# Altium project ROV_Voltage_Switch_1.1.PrjPcb (part 1 of 2)
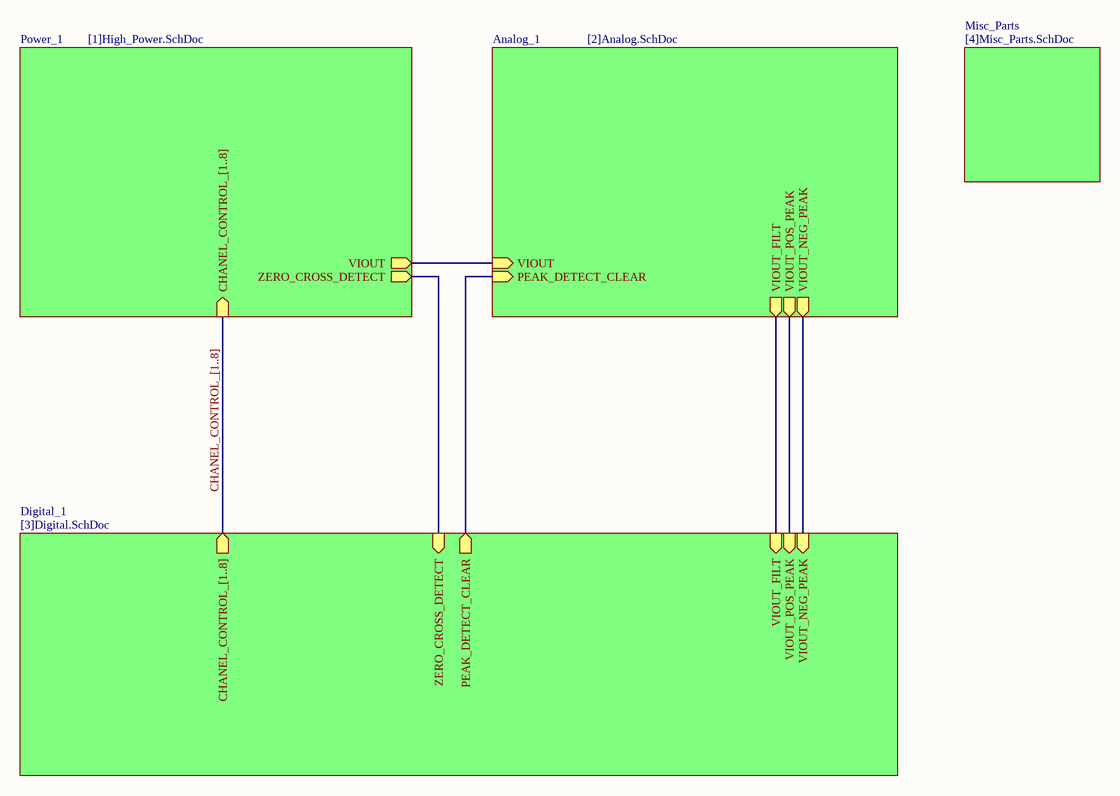
[diagram p0: [0]Top.SchDoc]
6 sheets, 303 parts. Net scope: hierarchical (ports join the sheet entries above them; power ports are global).
Board file: ROV_Voltage_Switch_1.1.PcbDoc
Sheets:
  [0]Top.SchDoc
    Power_1 = [1]High_Power.SchDoc
      MOC_CH_1 = [1.1]MOC_Channel.SchDoc
      MOC_CH_2 = [1.1]MOC_Channel.SchDoc
      MOC_CH_3 = [1.1]MOC_Channel.SchDoc
      MOC_CH_4 = [1.1]MOC_Channel.SchDoc
      MOC_CH_5 = [1.1]MOC_Channel.SchDoc
      MOC_CH_6 = [1.1]MOC_Channel.SchDoc
      MOC_CH_7 = [1.1]MOC_Channel.SchDoc
      MOC_CH_8 = [1.1]MOC_Channel.SchDoc
    Analog_1 = [2]Analog.SchDoc
    Digital_1 = [3]Digital.SchDoc
    Misc_Parts = [4]Misc_Parts.SchDoc

## Sheet [0]Top.SchDoc
size A4

### Sub-sheets
Analog_1 = [2]Analog.SchDoc: VIOUT (in), VIOUT_FILT (out), VIOUT_NEG_PEAK (out), PEAK_DETECT_CLEAR (in), VIOUT_POS_PEAK (out)
Digital_1 = [3]Digital.SchDoc: ZERO_CROSS_DETECT (in), VIOUT_FILT (in), VIOUT_NEG_PEAK (in), VIOUT_POS_PEAK (in), PEAK_DETECT_CLEAR (out), CHANEL_CONTROL_[1..8] (out)
Misc_Parts = [4]Misc_Parts.SchDoc: no entries
Power_1 = [1]High_Power.SchDoc: VIOUT (out), ZERO_CROSS_DETECT (out), CHANEL_CONTROL_[1..8] (in)

### Nets
VIOUT: sheet Power_1/VIOUT, sheet Analog_1/VIOUT
VIOUT_NEG_PEAK: sheet Analog_1/VIOUT_NEG_PEAK, sheet Digital_1/VIOUT_NEG_PEAK
VIOUT_POS_PEAK: sheet Analog_1/VIOUT_POS_PEAK, sheet Digital_1/VIOUT_POS_PEAK
NetOPT1_5: sheet Power_1/ZERO_CROSS_DETECT, sheet Digital_1/ZERO_CROSS_DETECT
NetP9_1: sheet Analog_1/VIOUT_FILT, sheet Digital_1/VIOUT_FILT
NetP17_1: sheet Analog_1/PEAK_DETECT_CLEAR, sheet Digital_1/PEAK_DETECT_CLEAR

### Buses and harness runs
bus CHANEL_CONTROL_[1..8] = sheet Digital_1/CHANEL_CONTROL_[1..8] = sheet Power_1/CHANEL_CONTROL_[1..8]

## Sheet [1]High_Power.SchDoc
size A1
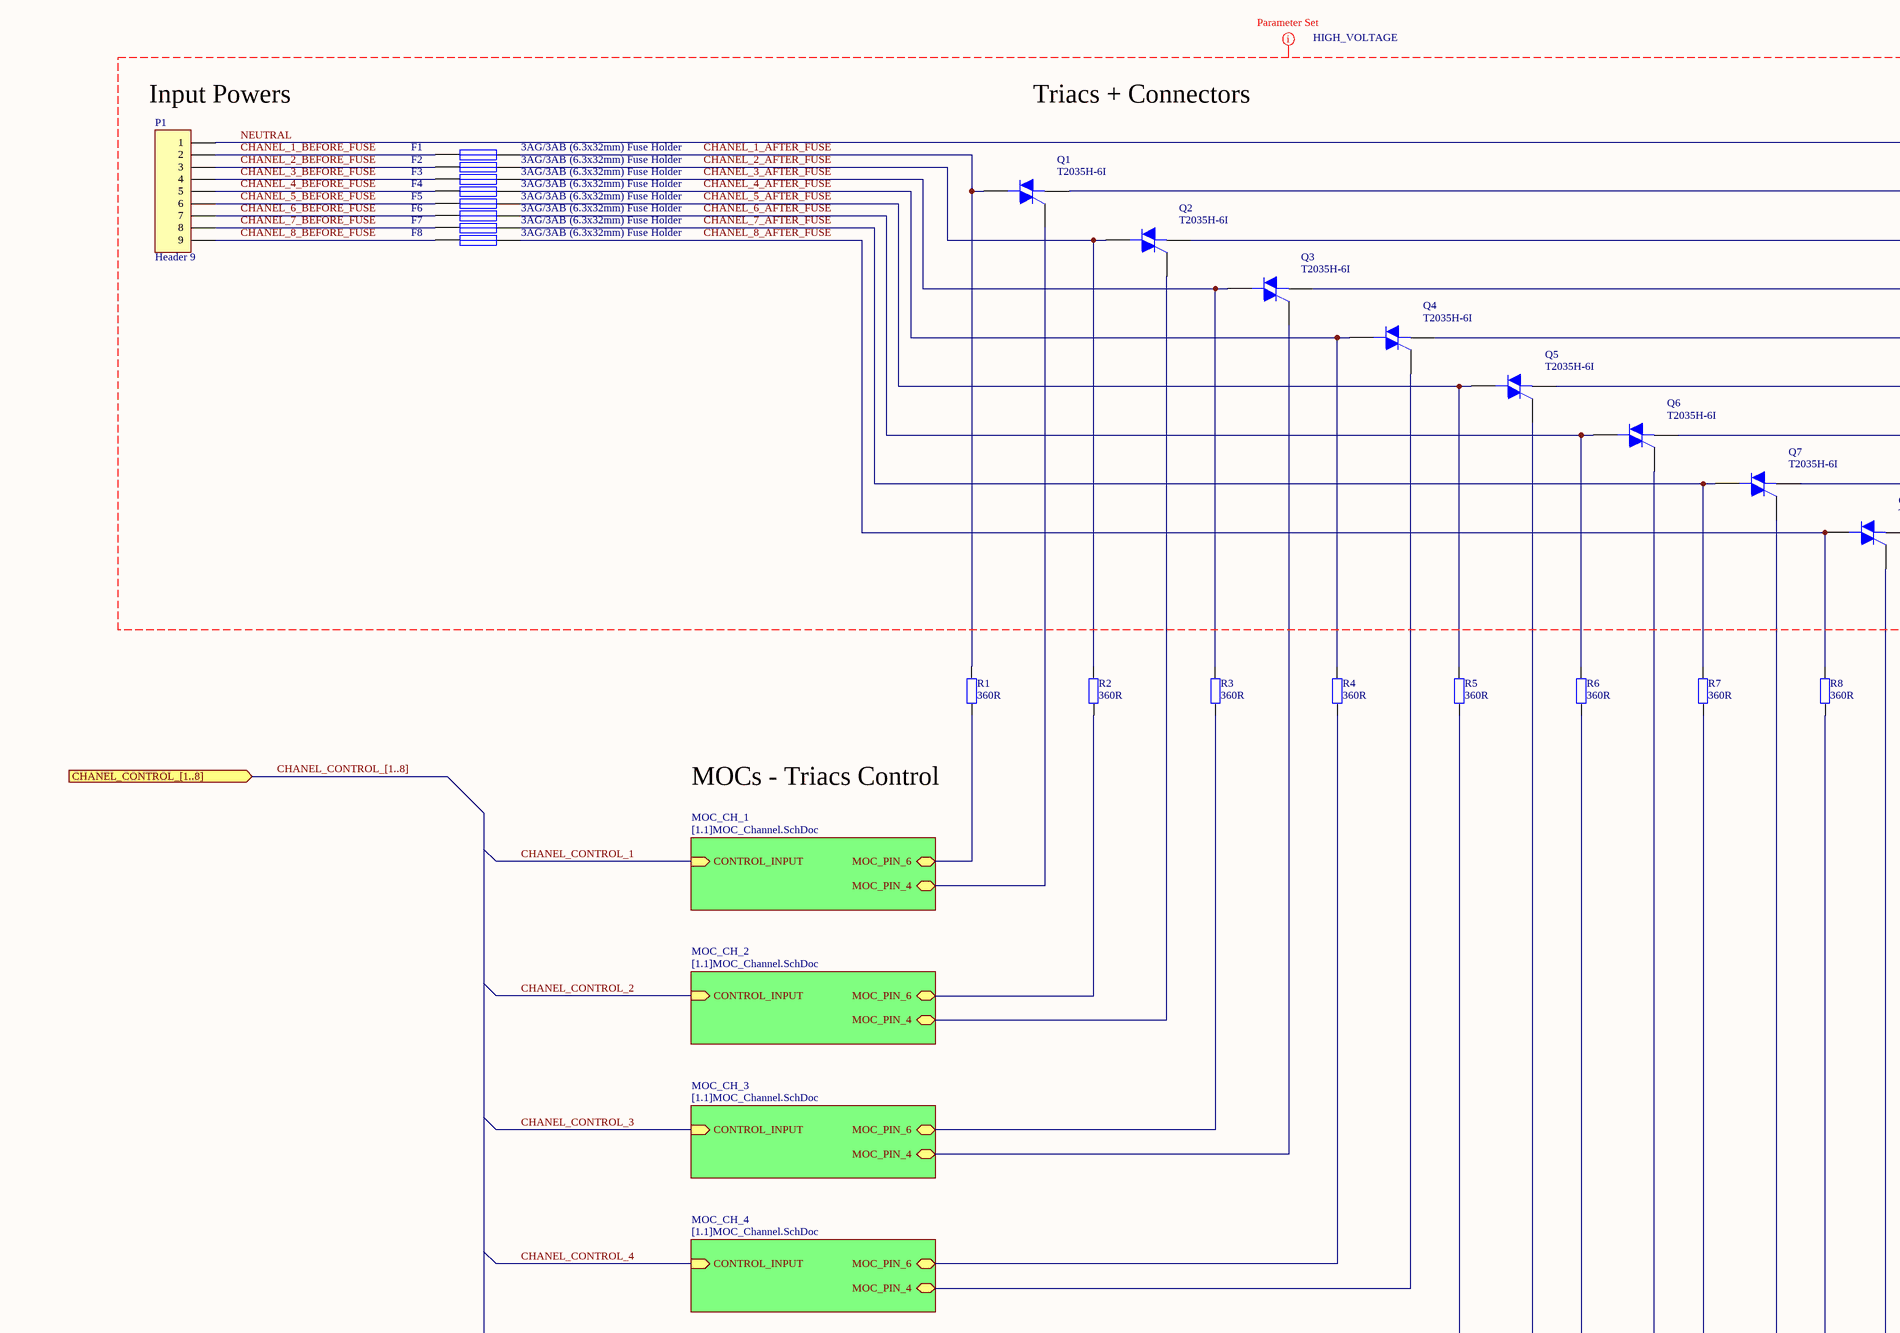
[diagram p1: [1]High_Power.SchDoc, top left]
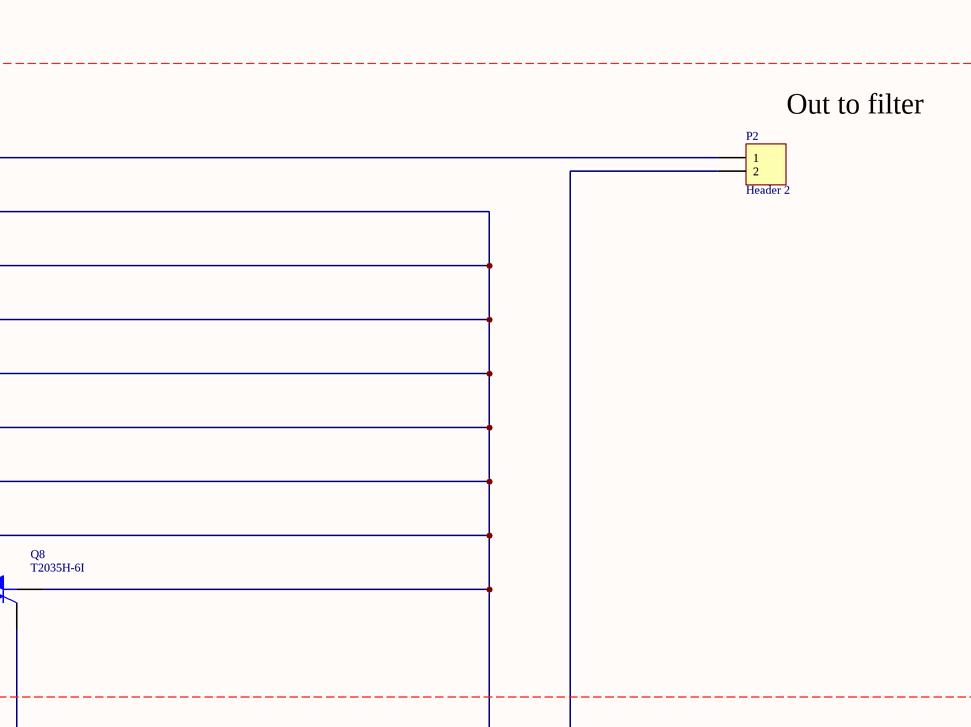
[diagram p2: [1]High_Power.SchDoc, top right]
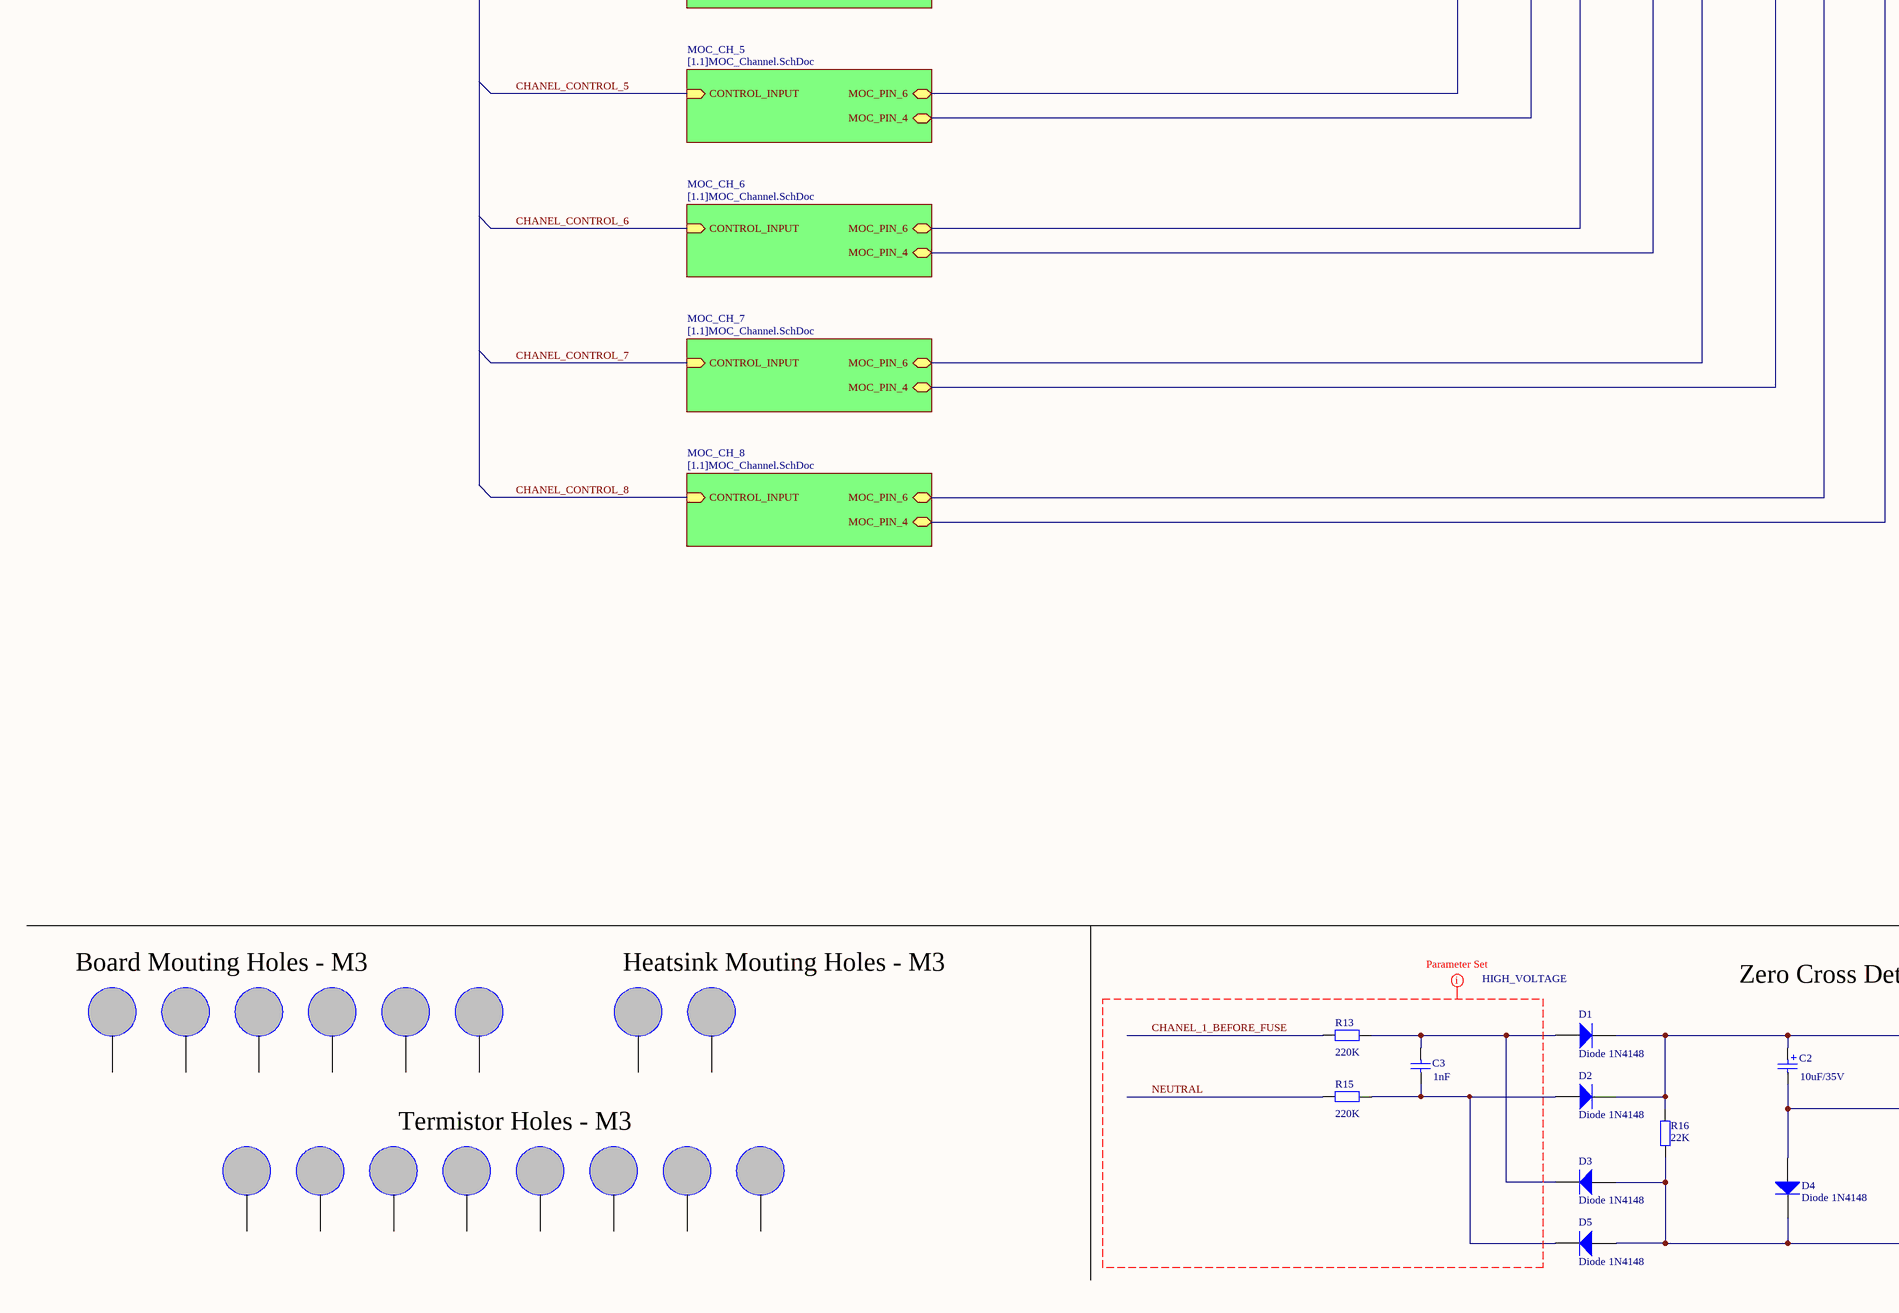
[diagram p3: [1]High_Power.SchDoc, bottom left]
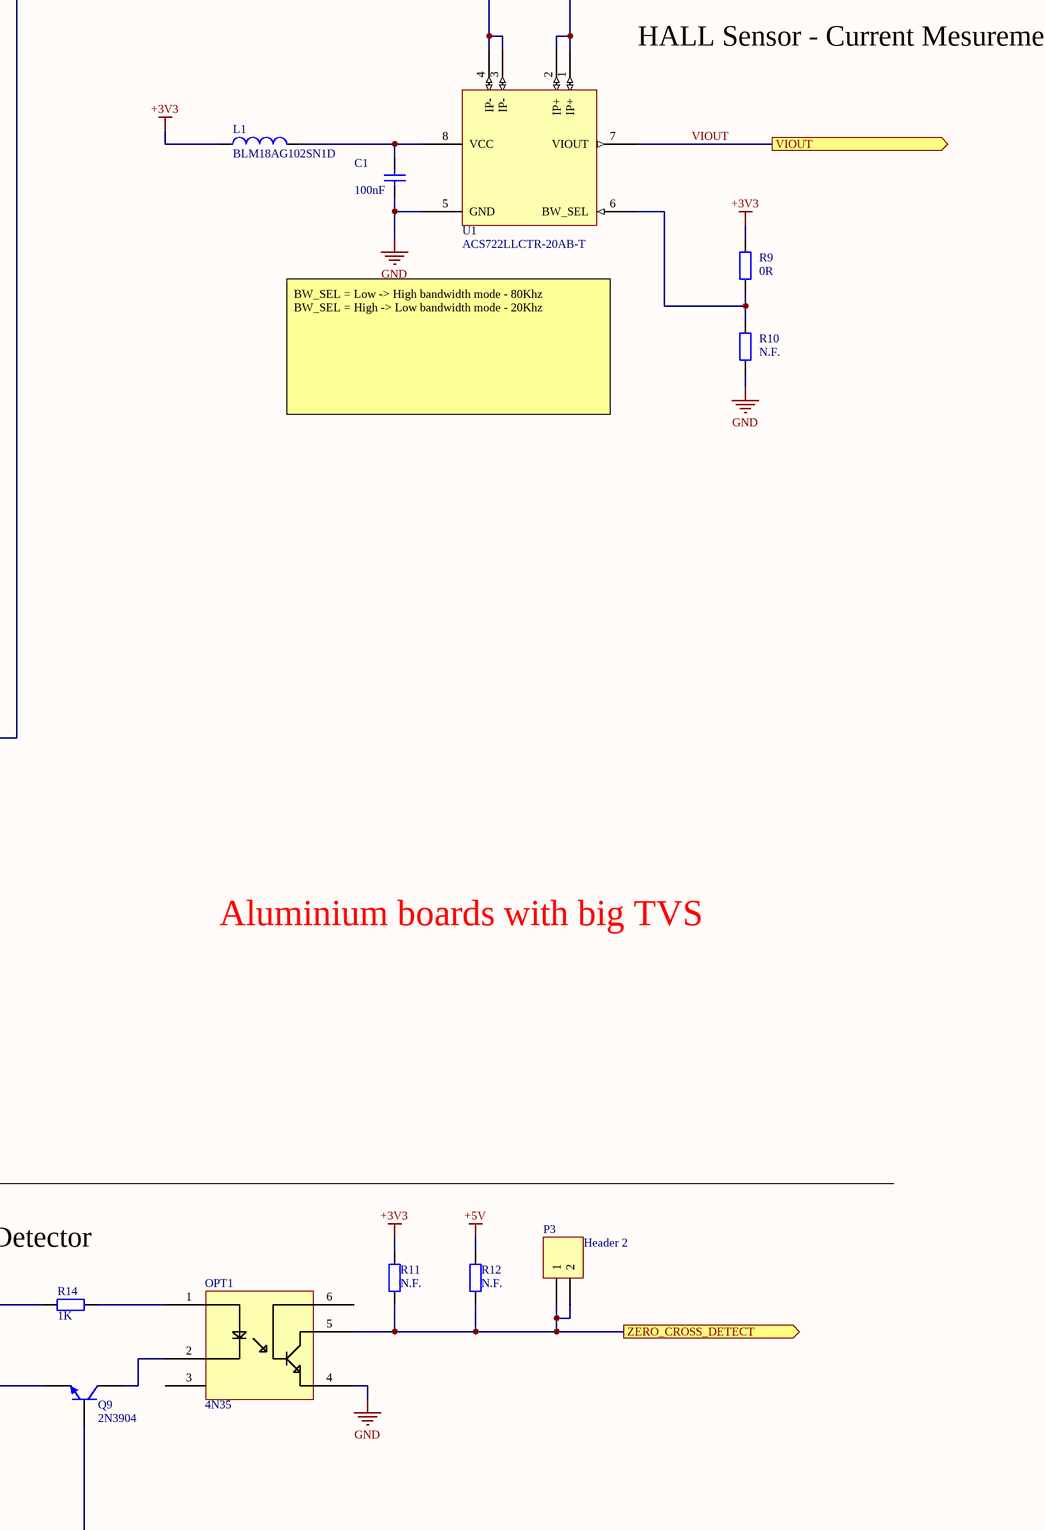
[diagram p4: [1]High_Power.SchDoc, bottom right]

### Parts
C1  value 100nF  [1608[0603]]  (hidden comment: 0603)
C2  value 10uF/35V  [WCAP-ATG5 Capacitor]  (hidden comment: Cap Pol2)
C3  value 1nF  [R82 Capacitors]  (hidden comment: 0603)
D1  Diode 1N4148  [DO-35]
D2  Diode 1N4148  [DO-35]
D3  Diode 1N4148  [DO-35]
D4  Diode 1N4148  [DO-35]
D5  Diode 1N4148  [DO-35]
F1  3AG/3AB (6.3x32mm) Fuse Holder  [03540101ZXGY]
F2  3AG/3AB (6.3x32mm) Fuse Holder  [03540101ZXGY]
F3  3AG/3AB (6.3x32mm) Fuse Holder  [03540101ZXGY]
F4  3AG/3AB (6.3x32mm) Fuse Holder  [03540101ZXGY]
F5  3AG/3AB (6.3x32mm) Fuse Holder  [03540101ZXGY]
F6  3AG/3AB (6.3x32mm) Fuse Holder  [03540101ZXGY]
F7  3AG/3AB (6.3x32mm) Fuse Holder  [03540101ZXGY]
F8  3AG/3AB (6.3x32mm) Fuse Holder  [03540101ZXGY]
L1  BLM18AG102SN1D  [1608[0603]]
MH1  Mouting Hole  [M3 Mounting Hole]  (value not drawn)  (no BOM)
MH2  Mouting Hole  [M3 Mounting Hole]  (value not drawn)  (no BOM)
MH3  Mouting Hole  [M3 Mounting Hole]  (value not drawn)  (no BOM)
MH4  Mouting Hole  [M3 Mounting Hole]  (value not drawn)  (no BOM)
MH5  Mouting Hole  [M3 Mounting Hole]  (value not drawn)  (no BOM)
MH6  Mouting Hole  [M3 Mounting Hole]  (value not drawn)  (no BOM)
MH7  Mouting Hole  [M3 Mounting Hole]  (value not drawn)  (no BOM)
MH8  Mouting Hole  [M3 Mounting Hole]  (value not drawn)  (no BOM)
MH9  Mouting Hole  [M3 Mounting Hole]  (value not drawn)  (no BOM)
MH10  Mouting Hole  [M3 Mounting Hole]  (value not drawn)  (no BOM)
MH11  Mouting Hole  [M3 Mounting Hole]  (value not drawn)  (no BOM)
MH12  Mouting Hole  [M3 Mounting Hole]  (value not drawn)  (no BOM)
MH13  Mouting Hole  [M3 Mounting Hole]  (value not drawn)  (no BOM)
MH14  Mouting Hole  [M3 Mounting Hole]  (value not drawn)  (no BOM)
MH15  Mouting Hole  [M3 Mounting Hole]  (value not drawn)  (no BOM)
MH16  Mouting Hole  [M3 Mounting Hole]  (value not drawn)  (no BOM)
OPT1  4N35  [DIP-6]
P1  Header 9  [Phoenix Contact 1732351]
P2  Header 2  [Phoenix Contact 1731721]
P3  Header 2  [HDR1X2]
Q1  T2035H-6I  [TO-220 +3D]
Q2  T2035H-6I  [TO-220 +3D]
Q3  T2035H-6I  [TO-220 +3D]
Q4  T2035H-6I  [TO-220 +3D]
Q5  T2035H-6I  [TO-220 +3D]
Q6  T2035H-6I  [TO-220 +3D]
Q7  T2035H-6I  [TO-220 +3D]
Q8  T2035H-6I  [TO-220 +3D]
Q9  2N3904  [TO-92A]
R1  value 360R  [AXIAL-0.4]  (hidden comment: Res2)
R2  value 360R  [AXIAL-0.4]  (hidden comment: Res2)
R3  value 360R  [AXIAL-0.4]  (hidden comment: Res2)
R4  value 360R  [AXIAL-0.4]  (hidden comment: Res2)
R5  value 360R  [AXIAL-0.4]  (hidden comment: Res2)
R6  value 360R  [AXIAL-0.4]  (hidden comment: Res2)
R7  value 360R  [AXIAL-0.4]  (hidden comment: Res2)
R8  value 360R  [AXIAL-0.4]  (hidden comment: Res2)
R9  value 0R  [J1-0603]  (hidden comment: 0603)
R10  value N.F.  [J1-0603]  (hidden comment: 0603)
R11  value N.F.  [J1-0603]  (hidden comment: 0603)
R12  value N.F.  [J1-0603]  (hidden comment: 0603)
R13  value 220K  [AXIAL-0.4]  (hidden comment: Res2)
R14  value 1K  [AXIAL-0.4]  (hidden comment: Res2)
R15  value 220K  [AXIAL-0.4]  (hidden comment: Res2)
R16  value 22K  [AXIAL-0.4]  (hidden comment: Res2)
U1  ACS722LLCTR-20AB-T  [SOIC127P600-8CL]

### Sub-sheets
MOC_CH_1 = [1.1]MOC_Channel.SchDoc: MOC_PIN_4 (bidir), CONTROL_INPUT (in), MOC_PIN_6 (bidir)
MOC_CH_2 = [1.1]MOC_Channel.SchDoc: MOC_PIN_4 (bidir), CONTROL_INPUT (in), MOC_PIN_6 (bidir)
MOC_CH_3 = [1.1]MOC_Channel.SchDoc: MOC_PIN_4 (bidir), CONTROL_INPUT (in), MOC_PIN_6 (bidir)
MOC_CH_4 = [1.1]MOC_Channel.SchDoc: MOC_PIN_4 (bidir), CONTROL_INPUT (in), MOC_PIN_6 (bidir)
MOC_CH_5 = [1.1]MOC_Channel.SchDoc: MOC_PIN_4 (bidir), CONTROL_INPUT (in), MOC_PIN_6 (bidir)
MOC_CH_6 = [1.1]MOC_Channel.SchDoc: MOC_PIN_4 (bidir), CONTROL_INPUT (in), MOC_PIN_6 (bidir)
MOC_CH_7 = [1.1]MOC_Channel.SchDoc: MOC_PIN_4 (bidir), CONTROL_INPUT (in), MOC_PIN_6 (bidir)
MOC_CH_8 = [1.1]MOC_Channel.SchDoc: MOC_PIN_4 (bidir), CONTROL_INPUT (in), MOC_PIN_6 (bidir)

### Ports
CHANEL_CONTROL_[1..8] (in), VIOUT (out), ZERO_CROSS_DETECT (out)

### Nets
+3V3: L1.1 R9.2 R11.1
+5V: R12.1
GND: C1.1 OPT1.4(E) R10.1 U1.5(GND)
CHANEL_1_AFTER_FUSE: F1.2 Q1.2(M2) R1.2
CHANEL_1_BEFORE_FUSE: F1.1 P1.2 R13.1
CHANEL_2_AFTER_FUSE: F2.2 Q2.2(M2) R2.2
CHANEL_2_BEFORE_FUSE: F2.1 P1.3
CHANEL_3_AFTER_FUSE: F3.2 Q3.2(M2) R3.2
CHANEL_3_BEFORE_FUSE: F3.1 P1.4
CHANEL_4_AFTER_FUSE: F4.2 Q4.2(M2) R4.2
CHANEL_4_BEFORE_FUSE: F4.1 P1.5
CHANEL_5_AFTER_FUSE: F5.2 Q5.2(M2) R5.2
CHANEL_5_BEFORE_FUSE: F5.1 P1.6
CHANEL_6_AFTER_FUSE: F6.2 Q6.2(M2) R6.2
CHANEL_6_BEFORE_FUSE: F6.1 P1.7
CHANEL_7_AFTER_FUSE: F7.2 Q7.2(M2) R7.2
CHANEL_7_BEFORE_FUSE: F7.1 P1.8
CHANEL_8_AFTER_FUSE: F8.2 Q8.2(M2) R8.2
CHANEL_8_BEFORE_FUSE: F8.1 P1.9
NEUTRAL: P1.1 P2.1 R15.1
VIOUT: U1.7(VIOUT) ; port VIOUT
Net1MOC1_4: Q1.3(G) ; sheet MOC_CH_1/MOC_PIN_4
Net1MOC1_6: R1.1 ; sheet MOC_CH_1/MOC_PIN_6
Net2MOC1_4: Q2.3(G) ; sheet MOC_CH_2/MOC_PIN_4
Net2MOC1_6: R2.1 ; sheet MOC_CH_2/MOC_PIN_6
Net3MOC1_4: Q3.3(G) ; sheet MOC_CH_3/MOC_PIN_4
Net3MOC1_6: R3.1 ; sheet MOC_CH_3/MOC_PIN_6
Net4MOC1_4: Q4.3(G) ; sheet MOC_CH_4/MOC_PIN_4
Net4MOC1_6: R4.1 ; sheet MOC_CH_4/MOC_PIN_6
Net5MOC1_4: Q5.3(G) ; sheet MOC_CH_5/MOC_PIN_4
Net5MOC1_6: R5.1 ; sheet MOC_CH_5/MOC_PIN_6
Net6MOC1_4: Q6.3(G) ; sheet MOC_CH_6/MOC_PIN_4
Net6MOC1_6: R6.1 ; sheet MOC_CH_6/MOC_PIN_6
Net7MOC1_4: Q7.3(G) ; sheet MOC_CH_7/MOC_PIN_4
Net7MOC1_6: R7.1 ; sheet MOC_CH_7/MOC_PIN_6
Net8MOC1_4: Q8.3(G) ; sheet MOC_CH_8/MOC_PIN_4
Net8MOC1_6: R8.1 ; sheet MOC_CH_8/MOC_PIN_6
NetC1_2: C1.2 L1.2 U1.8(VCC)
NetC2_1: C2.1 D1.2(K) D2.2(K) R14.2 R16.2
NetC2_2: C2.2 D4.1(A) Q9.1(E)
NetC3_1: C3.1 D2.1(A) D5.2(K) R15.2
NetC3_2: C3.2 D1.1(A) D3.2(K) R13.2
NetD3_1: D3.1(A) D4.2(K) D5.1(A) Q9.2(B) R16.1
NetOPT1_1: OPT1.1(A) R14.1
NetOPT1_2: OPT1.2(C) Q9.3(C)
NetOPT1_5: OPT1.5(C) P3.1 P3.2 R11.2 R12.2 ; port ZERO_CROSS_DETECT
NetP2_2: P2.2 U1.1(IP+) U1.2(IP+)
NetQ1_1: Q1.1(M1) Q2.1(M1) Q3.1(M1) Q4.1(M1) Q5.1(M1) Q6.1(M1) Q7.1(M1) Q8.1(M1) U1.3(IP-) U1.4(IP-)
NetR9_1: R9.1 R10.2 U1.6(BW_SEL)

Not connected (* = marked no-connect by the designer): MH1 1; MH2 1; MH3 1; MH4 1; MH5 1; MH6 1; MH7 1; MH8 1; MH9 1; MH10 1; MH11 1; MH12 1; MH13 1; MH14 1; MH15 1; MH16 1; OPT1 3(NC) 6(B)

### Buses and harness runs
bus CHANEL_CONTROL_[1..8] = port CHANEL_CONTROL_[1..8]

### Layout directives
net class HIGH_VOLTAGE: CHANEL_1_AFTER_FUSE, CHANEL_1_BEFORE_FUSE, CHANEL_2_AFTER_FUSE, CHANEL_2_BEFORE_FUSE, CHANEL_3_AFTER_FUSE, CHANEL_3_BEFORE_FUSE, CHANEL_4_AFTER_FUSE, CHANEL_4_BEFORE_FUSE, CHANEL_5_AFTER_FUSE, CHANEL_5_BEFORE_FUSE, CHANEL_6_AFTER_FUSE, CHANEL_6_BEFORE_FUSE, CHANEL_7_AFTER_FUSE, CHANEL_7_BEFORE_FUSE, CHANEL_8_AFTER_FUSE, CHANEL_8_BEFORE_FUSE, NEUTRAL

### Notes on the sheet
- (near P1) Input Powers
- Triacs + Connectors
- Out to filter
- MOCs - Triacs Control
- HALL Sensor - Current Mesurement
- BW_SEL = Low -> High bandwidth mode - 80Khz
  BW_SEL = High -> Low bandwidth mode - 20Khz
- Aluminium boards with big TVS
- Board Mouting Holes - M3
- Heatsink Mouting Holes - M3
- Zero Cross Detector
- Termistor Holes - M3

### Library data of the parts
C1 = Cap: Capacitor; Note: We have them in Bulgaria; Published: 8-Jun-2000; LatestRevisionDate: 17-Jul-2002; LatestRevisionNote: Re-released for DXP Platform.; PackageReference: RAD-0.3; Publisher: Altium Limited; PackageDescription: Radial Cap, Thru-Hole; 2 Leads; 0.3 in Pin Spacing; Distributor Link: http://uk.farnell.com/kemet/c0603x104k4ractu/cap-mlcc-x7r-100nf-16v-0603/dp/1414027; Case Code (in): 0603
C2 = Cap Pol2: Polarized Capacitor (Axial); Manufacturer Name: Wurth Elektronik; Manufacturer Part No.: 860010572002; Published: 8-Jun-2000; LatestRevisionDate: 17-Jul-2002; LatestRevisionNote: Re-released for DXP Platform.; PackageReference: POLAR0.8; Publisher: Altium Limited; PackageDescription: Polarized Capacitor; 2 Leads; Distributor Link: https://eu.mouser.com/ProductDetail/Wurth-Elektronik/860010572002?qs=sGAEpiMZZMtZ1n0r9vR22emd73sC8nR%2FeIw40At6znBuqpN1zy5iZQ%3D%3D
C3 = Cap: Capacitor; Manufacturer Name: Kemet; Manufacturer Part No.: R82EC1100SH50J; Published: 8-Jun-2000; LatestRevisionDate: 17-Jul-2002; LatestRevisionNote: Re-released for DXP Platform.; PackageReference: RAD-0.3; Publisher: Altium Limited; PackageDescription: Radial Cap, Thru-Hole; 2 Leads; 0.3 in Pin Spacing; Distributor Link: https://eu.mouser.com/ProductDetail/KEMET/R82EC1100SH50J?qs=Jv4FAWB%252B0HZZcejnl%252BmKFw%3D%3D
D1-D5 = Diode 1N4148: High Conductance Fast Diode; Manufacturer Name: ON Semiconductor / Fairchild; Published: 8-Jun-2000; LatestRevisionDate: 17-Jul-2002; LatestRevisionNote: Re-released for DXP Platform.; DatasheetVersion: 1997; PackageReference: DO-35; Publisher: Altium Limited; PackageDescription: Diode, Axial; Body 3.8 x 1.9 mm (LxDia. max), Lead Dia. 0.53 mm (max); Code_JEDEC: DO-204-AH; ComponentLink1Description: Manufacturer Link; ComponentLink1URL: http://www.fairchildsemi.com/; ComponentLink2Description: Datasheet; ComponentLink2URL: http://www.fairchildsemi.com/ds/1N%2F1N4148.pdf; Distributor Link: https://www.mouser.co.uk/ProductDetail/ON-Semiconductor-Fairchild/1N4148?qs=i4Fj9T%2FoRm8RMUhj5DeFQg%3D%3D; Manufacturer Part No.: 1N4148
F1-F8 = Fuse 1: Fuse; Manufacturer Name: Littelfuse; Published: 8-Jun-2000; LatestRevisionDate: 17-Jul-2002; LatestRevisionNote: Re-released for DXP Platform.; PackageReference: PIN-W2/E2.8; Publisher: Altium Limited; PackageDescription: Thru-Hole; 2 Leads; Distributor Link: https://eu.mouser.com/ProductDetail/Littelfuse/03540101ZXGY?qs=gu7KAQ731USHq53hZeD4aA%3D%3D; Manufacturer Part No.: 03540101ZXGY
L1 = Inductor: Manufacturer Name: Murata; Note: We have them in Bulgaria; Manufacturer Part No.: BLM18AG102SN1D; Distributor Link: https://eu.mouser.com/ProductDetail/Murata-Electronics/BLM18AG102SN1D?qs=%2fha2pyFadui%252bmEFJIul6r5GpWOyARRlB97lxmShlzChqi9G%252bTjWC9w%3d%3d
OPT1 = 4N35: Optocoupler, Phototransistor Output, with Base Connection; Manufacturer Name: VISHAY; Note: Get 3 more; Distributor Link: https://uk.farnell.com/vishay/4n35/optocoupler-phototransistor-5000vrms/dp/1328375; Manufacturer Part No.: 4N35
P1 = Header 9: Header, 9-Pin; Manufacturer Name: 1732351; Manufacturer Part No.: Phoenix Contact; LatestRevisionDate: 17-Jul-2002; LatestRevisionNote: Re-released for DXP Platform.; Publisher: Altium Limited; Distributor Link: https://eu.mouser.com/ProductDetail/Phoenix-Contact/1732351?qs=%2Fha2pyFaduil4dlFYt6J%252B%2F5QyjaYJ9xdI09CSKJ9bpIMs31xZuIXQ81zvmcHehum
P2 = Header 2: Header, 2-Pin; Manufacturer Name: Phoenix Contact; Manufacturer Part No.: 1732351; LatestRevisionDate: 17-Jul-2002; LatestRevisionNote: Re-released for DXP Platform.; Publisher: Altium Limited; Distributor Link: https://www.mouser.co.uk/ProductDetail/651-1732351
P3 = Header 2: Header, 2-Pin; LatestRevisionDate: 17-Jul-2002; LatestRevisionNote: Re-released for DXP Platform.; Publisher: Altium Limited
Q1-Q8 = Triac: Silicon Bidirectional Triode Thyristor; Manufacturer Name: STMicroelectronics; Note: Get 30 more of those.; Published: 29-Sep-2000; LatestRevisionDate: 17-Jul-2002; LatestRevisionNote: Re-released for DXP Platform.; DatasheetVersion: 1999; PackageReference: 369-03; Publisher: Altium Limited; PackageDescription: TO, Thru-Hole, Vertical, Heatsink Mounted; 3 In-Line Leads; Pitch 2.28 mm; ComponentLink1Description: Manufacturer Link; ComponentLink1URL: http://www.motorola.com/; Distributor Link: https://eu.mouser.com/ProductDetail/STMicroelectronics/T2035H-6I?qs=%2Fha2pyFaduhTzOBoTM%252BH2lIkzhHcz3YMyX%252BQq7FR7LM%3D; Manufacturer Part No.: T2035H-6I
Q9 = 2N3904: NPN General Purpose Amplifier; Manufacturer Name: MULTICOMP; Published: 8-Jun-2000; LatestRevisionDate: 15-Jan-2003; LatestRevisionNote: PCB Footprint 'BCY-W3/D4.7' replaced; DatasheetVersion: 1997; PackageVersion: Sep-1998; PackageReference: TO-92A; Publisher: Altium Limited; PackageDescription: TO, Flat Index; 3 In-Line, Axial Leads; Body Dia. 4.5mm; Leads 0.51 x 0.48 mm (max); ComponentLink1Description: Manufacturer Link; ComponentLink1URL: http://www.fairchildsemi.com/; ComponentLink2Description: Datasheet; ComponentLink2URL: http://www.fairchildsemi.com/ds/2N%2F2N3904.pdf; Distributor Link: https://uk.farnell.com/multicomp/2n3904/transistor-npn-to-92/dp/1574370?st=2N3904; Manufacturer Part No.: 2N3904
R1-R8 R13-R16 = Res2: Resistor; Note: Get 6 more of those.; Published: 8-Jun-2000; LatestRevisionDate: 17-Jul-2002; LatestRevisionNote: Re-released for DXP Platform.; PackageReference: AXIAL-0.4; Publisher: Altium Limited; PackageDescription: Axial Device, Thru-Hole; 2 Leads; 0.4 in Pin Spacing; Case Code (in): AXIAL-0.3
  R1-R8: Distributor Link: https://eu.mouser.com/ProductDetail/Yageo/CFR-25JB-52-360R?qs=sGAEpiMZZMsPqMdJzcrNwqM9OSsfvmTTETvHHPXiM%2FLP9NH589sNFg%3D%3D
  R13 R15: Distributor Link: https://eu.mouser.com/ProductDetail/Yageo/CFR-25JT-52-220K?qs=sGAEpiMZZMsPqMdJzcrNwiPCnpFTGbbhcMzgIt4VkwM%3D
  R14: Distributor Link: https://eu.mouser.com/ProductDetail/Yageo/CFR-12JT-52-1K?qs=sGAEpiMZZMsPqMdJzcrNwnIafLS3rQ8ceX3eBr2isTY%3D
  R16: Distributor Link: https://eu.mouser.com/ProductDetail/Vishay-Dale/CCF0722K0JKE36?qs=sGAEpiMZZMsPqMdJzcrNwpBqoc5gprOUzoFaNNDlFDY%3D
R9-R12 = Res2: Resistor; Note: We have them in Bulgaria; Published: 8-Jun-2000; LatestRevisionDate: 17-Jul-2002; LatestRevisionNote: Re-released for DXP Platform.; PackageReference: AXIAL-0.4; Publisher: Altium Limited; PackageDescription: Axial Device, Thru-Hole; 2 Leads; 0.4 in Pin Spacing; Case Code (in): 0603
  R9: Distributor Link: http://uk.farnell.com/yageo/rc0603fr-070rl/res-thick-film-0r-1-0-1w-0603/dp/2309106
U1 = ACS723: High-Accuracy, Galvanically Isolated Current Sensor IC / with Small Footprint SOIC8 Package; Manufacturer Name: Allegro MicroSystems; Note: Get 5 more.; Distributor Link: https://www.digikey.com/product-detail/en/allegro-microsystems-llc/ACS722LLCTR-20AB-T/620-1637-1-ND/4948873; Manufacturer Part No.: ACS722LLCTR-20AB-T

## Sheet [1.1]MOC_Channel.SchDoc
size A4
Used 8 times, as channels Power_1/MOC_CH_1, Power_1/MOC_CH_2, Power_1/MOC_CH_3, Power_1/MOC_CH_4, Power_1/MOC_CH_5, Power_1/MOC_CH_6, Power_1/MOC_CH_7, Power_1/MOC_CH_8. Parts and nets are listed once, with the designators drawn on the sheet.
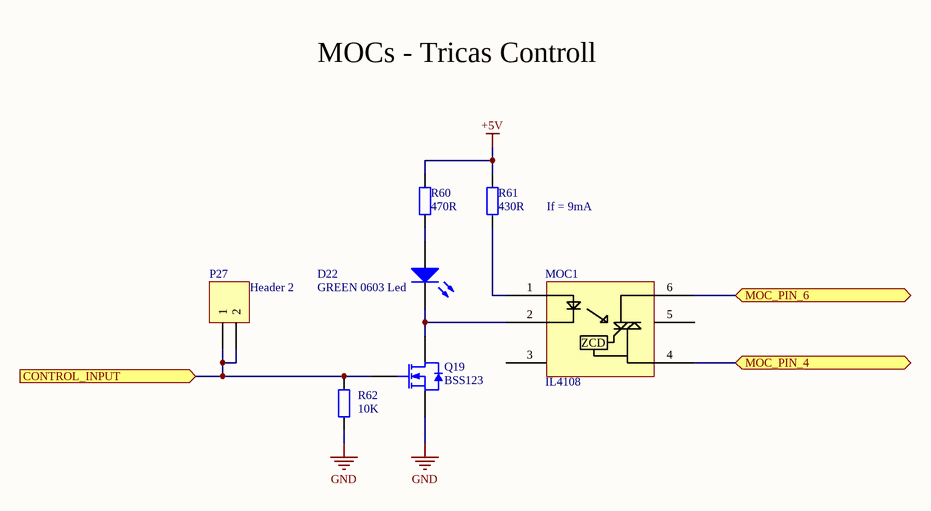
[diagram p5: [1.1]MOC_Channel.SchDoc]

### Parts
D22  GREEN 0603 Led  [LED0603]
MOC1  IL4108  [DIP-6]
P27  Header 2  [HDR1X2]
Q19  BSS123  [SOT23_N]
R60  value 470R  [J1-0603]  (hidden comment: 0603)
R61  value 430R  [J1-0603]  (hidden comment: 0603)
R62  value 10K  [J1-0603]  (hidden comment: 0603)

### Ports
CONTROL_INPUT (in), MOC_PIN_4 (bidir), MOC_PIN_6 (bidir)

### Nets
+5V: R60.2 R61.2
GND: Q19.2(S) R62.1
CONTROL_INPUT: P27.1 P27.2 Q19.1(G) R62.2 ; port CONTROL_INPUT
MOC_PIN_4: MOC1.4(E) ; port MOC_PIN_4
MOC_PIN_6: MOC1.6(B) ; port MOC_PIN_6
NetD22_1: D22.1(A) R60.1
NetD22_2: D22.2(K) MOC1.2(C) Q19.3(D)
NetMOC1_1: MOC1.1(A) R61.1

Not connected (* = marked no-connect by the designer): MOC1 3(NC) 5(C)

### Channels
Power_1/MOC_CH_1: designators D22=1D22 MOC1=1MOC1 P27=1P27 Q19=1Q19 R60=1R60 R61=1R61 R62=1R62; ports CONTROL_INPUT=CHANEL_CONTROL_1 MOC_PIN_4=Net1MOC1_4 MOC_PIN_6=Net1MOC1_6
Power_1/MOC_CH_2: designators D22=2D22 MOC1=2MOC1 P27=2P27 Q19=2Q19 R60=2R60 R61=2R61 R62=2R62; ports CONTROL_INPUT=CHANEL_CONTROL_2 MOC_PIN_4=Net2MOC1_4 MOC_PIN_6=Net2MOC1_6
Power_1/MOC_CH_3: designators D22=3D22 MOC1=3MOC1 P27=3P27 Q19=3Q19 R60=3R60 R61=3R61 R62=3R62; ports CONTROL_INPUT=CHANEL_CONTROL_3 MOC_PIN_4=Net3MOC1_4 MOC_PIN_6=Net3MOC1_6
Power_1/MOC_CH_4: designators D22=4D22 MOC1=4MOC1 P27=4P27 Q19=4Q19 R60=4R60 R61=4R61 R62=4R62; ports CONTROL_INPUT=CHANEL_CONTROL_4 MOC_PIN_4=Net4MOC1_4 MOC_PIN_6=Net4MOC1_6
Power_1/MOC_CH_5: designators D22=5D22 MOC1=5MOC1 P27=5P27 Q19=5Q19 R60=5R60 R61=5R61 R62=5R62; ports CONTROL_INPUT=CHANEL_CONTROL_5 MOC_PIN_4=Net5MOC1_4 MOC_PIN_6=Net5MOC1_6
Power_1/MOC_CH_6: designators D22=6D22 MOC1=6MOC1 P27=6P27 Q19=6Q19 R60=6R60 R61=6R61 R62=6R62; ports CONTROL_INPUT=CHANEL_CONTROL_6 MOC_PIN_4=Net6MOC1_4 MOC_PIN_6=Net6MOC1_6
Power_1/MOC_CH_7: designators D22=7D22 MOC1=7MOC1 P27=7P27 Q19=7Q19 R60=7R60 R61=7R61 R62=7R62; ports CONTROL_INPUT=CHANEL_CONTROL_7 MOC_PIN_4=Net7MOC1_4 MOC_PIN_6=Net7MOC1_6
Power_1/MOC_CH_8: designators D22=8D22 MOC1=8MOC1 P27=8P27 Q19=8Q19 R60=8R60 R61=8R61 R62=8R62; ports CONTROL_INPUT=CHANEL_CONTROL_8 MOC_PIN_4=Net8MOC1_4 MOC_PIN_6=Net8MOC1_6

### Notes on the sheet
- MOCs - Tricas Controll
- If = 9mA
- (in symbol MOC306x) ZCD

### Library data of the parts
D22 = LED0: Typical INFRARED GaAs LED; Manufacturer Name: KINGBRIGHT; Manufacturer Part No.: KPT-1608CGCK; Note: We have them in Bulgaria; Published: 8-Jun-2000; LatestRevisionDate: 08-Jul-2005; LatestRevisionNote: Mech Layer 1 removed.; PackageReference: LED-0; Publisher: Altium Limited; PackageDescription: LED; 2 Leads; Distributor Link: http://uk.farnell.com/kingbright/kpt-1608cgck/led-green-0603-smd/dp/2099220; Price (per 100 in GBP): 0.09
MOC1 = MOC306x: Optoisolators Trica Driver Output, With Zero Cross Detect; Manufacturer Name: Vishay Semiconductors; Note: Get 10 More; Distributor Link: https://eu.mouser.com/ProductDetail/Vishay-Semiconductors/IL4108?qs=xCMk%252BIHWTZOVWW5ZD8NmWQ==; Manufacturer Part No.: IL4108
P27 = Header 2: Header, 2-Pin; LatestRevisionDate: 17-Jul-2002; LatestRevisionNote: Re-released for DXP Platform.; Publisher: Altium Limited
Q19 = BSS123: N-channel Enhancement Mode Vertical D-MOSFET; Manufacturer Name: ON Semiconductor; Note: We have them in Bulgaria; Published: 17-Sep-2003; LatestRevisionDate: 12-Dec-2006; LatestRevisionNote: IPC-7351 Footprint Added.; DatasheetVersion: Apr-1995; PackageVersion: May-1999; PackageReference: SOT23; Publisher: Altium Limited; PackageDescription: 3-Pin SOT-23 Package 0.95 mm Pitch, 2.3 mm Lead Span; ComponentLink1Description: Manufacturer Link; ComponentLink1URL: http://www.semiconductors.philips.com/; ComponentLink2Description: Datasheet; ComponentLink2URL: http://www.semiconductors.philips.com/acrobat/datasheets/BSS123_3.pdf; Distributor Link: https://eu.mouser.com/ProductDetail/ON-Semiconductor/BSS123LT1G?qs=sGAEpiMZZMshyDBzk1%2fWizSW%252bwlCH%2fhMYWCTWBfWgg8%3d; Manufacturer Part No.: BSS123
R60-R62 = Res2: Resistor; Note: We have them in Bulgaria; Published: 8-Jun-2000; LatestRevisionDate: 17-Jul-2002; LatestRevisionNote: Re-released for DXP Platform.; PackageReference: AXIAL-0.4; Publisher: Altium Limited; PackageDescription: Axial Device, Thru-Hole; 2 Leads; 0.4 in Pin Spacing; Case Code (in): 0603
  R60: Distributor Link: https://uk.farnell.com/vishay/crcw0603470rfkea/res-470r-1-0-1w-0603-thick-film/dp/1469815RL
  R61: Distributor Link: https://uk.farnell.com/vishay/crcw0603430rfkea/res-430r-1-0-1w-0603-thick-film/dp/2141340
  R62: Distributor Link: http://uk.farnell.com/multicomp/mcwr06x1002ftl/res-thick-film-10k-1-0-1w-0603/dp/2447230

## Sheet [2]Analog.SchDoc
size A3
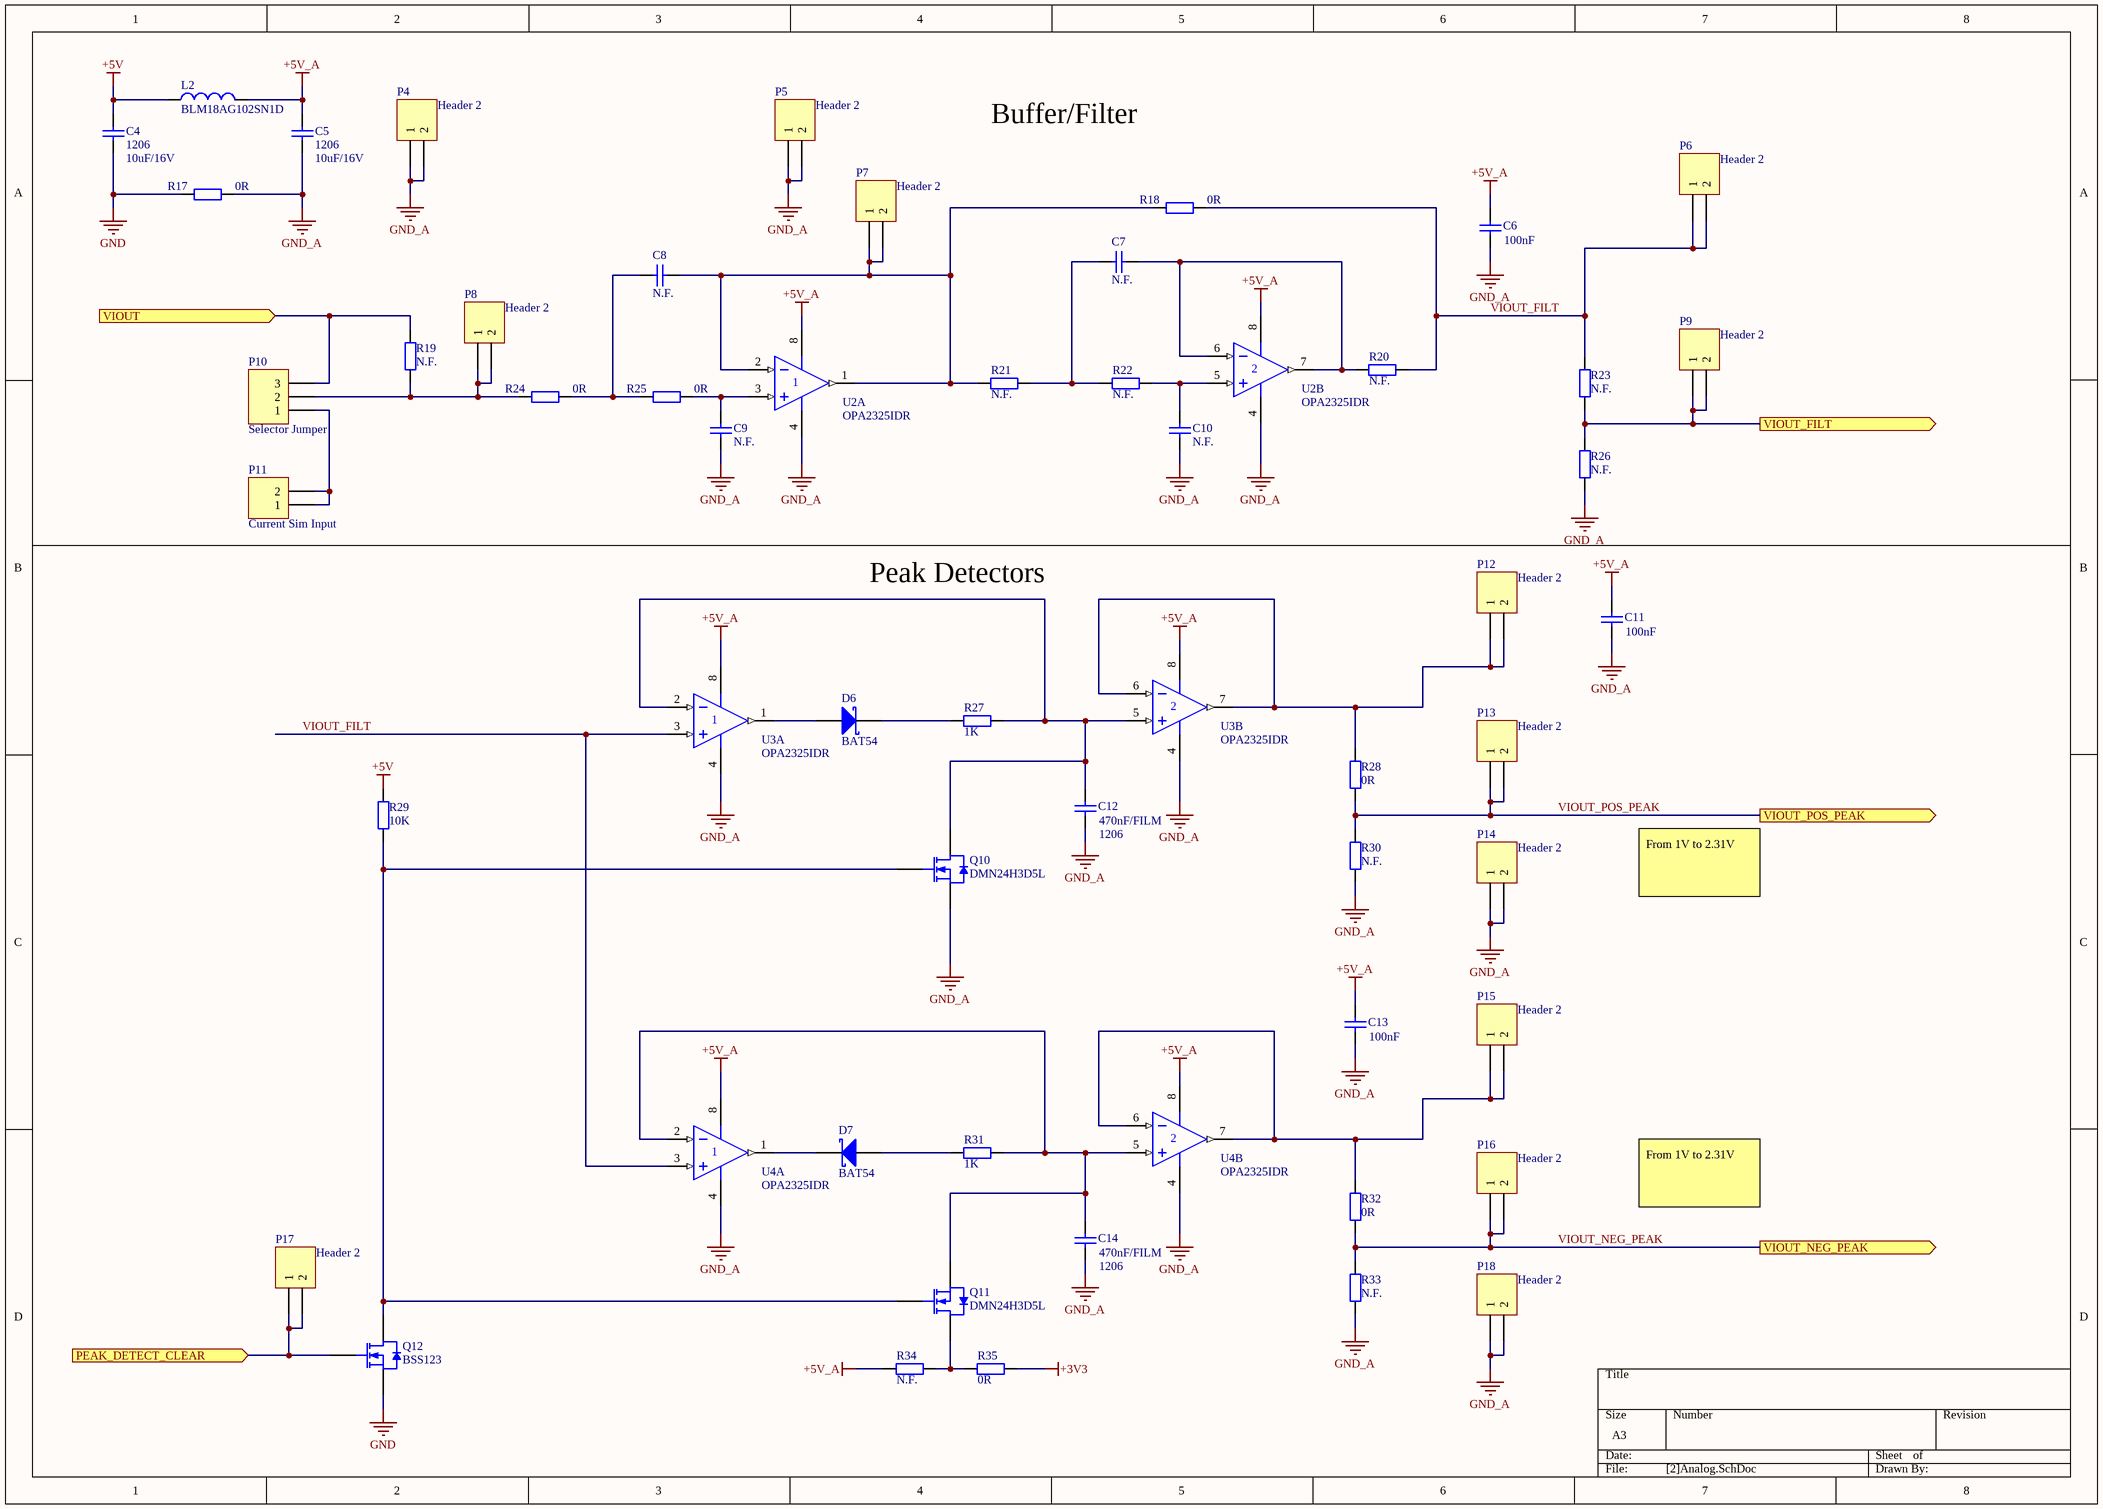
[diagram p6: [2]Analog.SchDoc]

### Parts
C4  1206  value 10uF/16V  [C1206]
C5  1206  value 10uF/16V  [C1206]
C6  value 100nF  [1608[0603]]  (hidden comment: 0603)
C7  value N.F.  [1608[0603]]  (hidden comment: 0603)
C8  value N.F.  [1608[0603]]  (hidden comment: 0603)
C9  value N.F.  [1608[0603]]  (hidden comment: 0603)
C10  value N.F.  [1608[0603]]  (hidden comment: 0603)
C11  value 100nF  [1608[0603]]  (hidden comment: 0603)
C12  value 470nF/FILM  Case Code (in): 1206  [C1206]  (hidden comment: 0603)
C13  value 100nF  [1608[0603]]  (hidden comment: 0603)
C14  value 470nF/FILM  Case Code (in): 1206  [C1206]  (hidden comment: 0603)
D6  BAT54  [SOT-23_N]
D7  BAT54  [SOT-23_N]
L2  BLM18AG102SN1D  [1608[0603]]
P4  Header 2  [HDR1X2]
P5  Header 2  [HDR1X2]
P6  Header 2  [HDR1X2]
P7  Header 2  [HDR1X2]
P8  Header 2  [HDR1X2]
P9  Header 2  [HDR1X2]
P10  Selector Jumper  [HDR1X3]
P11  Current Sim Input  [HDR1X2]
P12  Header 2  [HDR1X2]
P13  Header 2  [HDR1X2]
P14  Header 2  [HDR1X2]
P15  Header 2  [HDR1X2]
P16  Header 2  [HDR1X2]
P17  Header 2  [HDR1X2]
P18  Header 2  [HDR1X2]
Q10  DMN24H3D5L  [SOT23_N]
Q11  DMN24H3D5L  [SOT23_N]
Q12  BSS123  [SOT23_N]
R17  value 0R  [J1-0603]  (hidden comment: 0603)
R18  value 0R  [J1-0603]  (hidden comment: 0603)
R19  value N.F.  [J1-0603]  (hidden comment: 0603)
R20  value N.F.  [J1-0603]  (hidden comment: 0603)
R21  value N.F.  [J1-0603]  (hidden comment: 0603)
R22  value N.F.  [J1-0603]  (hidden comment: 0603)
R23  value N.F.  [J1-0603]  (hidden comment: 0603)
R24  value 0R  [J1-0603]  (hidden comment: 0603)
R25  value 0R  [J1-0603]  (hidden comment: 0603)
R26  value N.F.  [J1-0603]  (hidden comment: 0603)
R27  value 1K  [J1-0603]  (hidden comment: 0603)
R28  value 0R  [J1-0603]  (hidden comment: 0603)
R29  value 10K  [J1-0603]  (hidden comment: 0603)
R30  value N.F.  [J1-0603]  (hidden comment: 0603)
R31  value 1K  [J1-0603]  (hidden comment: 0603)
R32  value 0R  [J1-0603]  (hidden comment: 0603)
R33  value N.F.  [J1-0603]  (hidden comment: 0603)
R34  value N.F.  [J1-0603]  (hidden comment: 0603)
R35  value 0R  [J1-0603]  (hidden comment: 0603)
U2  OPA2325IDR  [D008_M]  (parts A,B of 2)
U3  OPA2325IDR  [D008_M]  (parts A,B of 2)
U4  OPA2325IDR  [D008_M]  (parts A,B of 2)

### Ports
PEAK_DETECT_CLEAR (in), VIOUT (in), VIOUT_FILT (out), VIOUT_NEG_PEAK (out), VIOUT_POS_PEAK (out)

### Nets
+3V3: R35.2
+5V: C4.2 L2.1 R29.2
+5V_A: C5.2 C6.2 C11.2 C13.2 L2.2 R34.1 U2.8(V+) U3.8(V+) U4.8(V+)
GND: C4.1 Q12.2(S) R17.2
GND_A: C5.1 C6.1 C9.2 C10.2 C11.1 C12.1 C13.1 C14.1 P4.1 P4.2 P5.1 P5.2 P14.1 P14.2 P18.1 P18.2 Q10.2(S) R17.1 R26.2 R30.2 R33.2 U2.4(V-) U3.4(V-) U4.4(V-)
VIOUT: P10.3 R19.1 ; port VIOUT
VIOUT_FILT: P6.1 P6.2 R18.1 R20.1 R23.1 U3.3(IN+) U4.3(IN+)
VIOUT_NEG_PEAK: P16.1 P16.2 R32.2 R33.1 ; port VIOUT_NEG_PEAK
VIOUT_POS_PEAK: P13.1 P13.2 R28.2 R30.1 ; port VIOUT_POS_PEAK
NetC7_1: C7.1 R20.2 U2.6(IN-) U2.7(OUT)
NetC7_2: C7.2 R21.1 R22.2
NetC8_1: C8.1 P7.1 P7.2 R18.2 R21.2 U2.1(OUT) U2.2(IN-)
NetC8_2: C8.2 R24.1 R25.2
NetC9_1: C9.1 R25.1 U2.3(IN+)
NetC10_1: C10.1 R22.1 U2.5(IN+)
NetC12_2: C12.2 Q10.3(D) R27.1 U3.2(IN-) U3.5(IN+)
NetC14_2: C14.2 Q11.2(S) R31.1 U4.2(IN-) U4.5(IN+)
NetD6_1: D6.1(A) U3.1(OUT)
NetD6_3: D6.3(K) R27.2
NetD7_1: D7.1(A) R31.2
NetD7_3: D7.3(K) U4.1(OUT)
NetP8_1: P8.1 P8.2 P10.2 R19.2 R24.2
NetP9_1: P9.1 P9.2 R23.2 R26.1 ; port VIOUT_FILT
NetP10_1: P10.1 P11.1 P11.2
NetP12_1: P12.1 P12.2 R28.1 U3.6(IN-) U3.7(OUT)
NetP15_1: P15.1 P15.2 R32.1 U4.6(IN-) U4.7(OUT)
NetP17_1: P17.1 P17.2 Q12.1(G) ; port PEAK_DETECT_CLEAR
NetQ10_1: Q10.1(G) Q11.1(G) Q12.3(D) R29.1
NetQ11_3: Q11.3(D) R34.2 R35.1

### Notes on the sheet
- Buffer/Filter
- Peak Detectors
- From 1V to 2.31V

### Library data of the parts
C4-C11 C13 = Cap: as C1 on sheet [1]High_Power; Published: 8-Jun-2000; LatestRevisionDate: 17-Jul-2002; LatestRevisionNote: Re-released for DXP Platform.; PackageReference: RAD-0.3; Publisher: Altium Limited; PackageDescription: Radial Cap, Thru-Hole; 2 Leads; 0.3 in Pin Spacing
  C4 C5: Distributor Link: http://uk.farnell.com/kemet/c1206c106k4ractu/cap-mlcc-x7r-10uf-16v-1206/dp/1463368; Case Code (in): 1206
  C6 C11 C13: Distributor Link: http://uk.farnell.com/kemet/c0603x104k4ractu/cap-mlcc-x7r-100nf-16v-0603/dp/1414027; Case Code (in): 0603
  C7-C10: Case Code (in): 0603
C12 C14 = Cap: Capacitor; Note: Get 6 more; Published: 8-Jun-2000; LatestRevisionDate: 17-Jul-2002; LatestRevisionNote: Re-released for DXP Platform.; PackageReference: RAD-0.3; Publisher: Altium Limited; PackageDescription: Radial Cap, Thru-Hole; 2 Leads; 0.3 in Pin Spacing; Distributor Link: https://eu.mouser.com/ProductDetail/Panasonic/ECP-U1C474MA5?qs=sGAEpiMZZMv1cc3ydrPrF%252BfZ13WJ%2Fr1%2Fb%252But97GYF3A%3D
D6 D7 = Diode BAT17: Silicon RF Schottky Diode for Mixer Applications in the VHF/UHF Range; Manufacturer Name: ON SEMICONDUCTOR; Manufacturer Part No.: BAT54LT1G; Note: We have them in Bulgaria; Published: 21-Mar-2003; LatestRevisionDate: 29-May-2009; LatestRevisionNote: IPC-7351 Footprint Added.; DatasheetVersion: Oct-1999; PackageVersion: Sep-2001; PackageReference: SOT-23; Publisher: Altium Limited; PackageDescription: 3-Pin SOT-23 Package 0.95 mm Pitch, 2.5 mm Lead Span; ComponentLink1Description: Manufacturer Link; ComponentLink1URL: http://www.infineon.com/; ComponentLink2Description: Datasheet; ComponentLink2URL: http://www.infineon.com/upload/Document/cmc_upload/documents/009/363/bat17series.pdf; Distributor Link: https://uk.farnell.com/on-semiconductor/bat54lt1g/diode-signal-30v-sot-23/dp/1431113
L2 = Inductor: as L1 on sheet [1]High_Power; Manufacturer Part No.: BLM18AG102SN1D; Distributor Link: https://eu.mouser.com/ProductDetail/Murata-Electronics/BLM18AG102SN1D?qs=%2fha2pyFadui%252bmEFJIul6r5GpWOyARRlB97lxmShlzChqi9G%252bTjWC9w%3d%3d
P4-P9 P11-P18 = Header 2: Header, 2-Pin; LatestRevisionDate: 17-Jul-2002; LatestRevisionNote: Re-released for DXP Platform.; Publisher: Altium Limited
P10 = Header 3: Header, 3-Pin; LatestRevisionDate: 17-Jul-2002; LatestRevisionNote: Re-released for DXP Platform.; Publisher: Altium Limited
Q10 Q11 = BSS123: N-channel Enhancement Mode Vertical D-MOSFET; Manufacturer Name: Diodes Incorporated; Manufacturer Part No.: DMN24H3D5L-7; Note: Get 5 more.; Published: 17-Sep-2003; LatestRevisionDate: 12-Dec-2006; LatestRevisionNote: IPC-7351 Footprint Added.; DatasheetVersion: Apr-1995; PackageVersion: May-1999; PackageReference: SOT23; Publisher: Altium Limited; PackageDescription: 3-Pin SOT-23 Package 0.95 mm Pitch, 2.3 mm Lead Span; ComponentLink1Description: Manufacturer Link; ComponentLink1URL: http://www.semiconductors.philips.com/; ComponentLink2Description: Datasheet; ComponentLink2URL: http://www.semiconductors.philips.com/acrobat/datasheets/BSS123_3.pdf; Distributor Link: https://www.digikey.com/product-detail/en/diodes-incorporated/DMN24H3D5L-7/DMN24H3D5L-7DICT-ND/5126865
Q12 = BSS123: as Q19 on sheet [1.1]MOC_Channel; Published: 17-Sep-2003; LatestRevisionDate: 12-Dec-2006; LatestRevisionNote: IPC-7351 Footprint Added.; DatasheetVersion: Apr-1995; PackageVersion: May-1999; PackageReference: SOT23; Publisher: Altium Limited; PackageDescription: 3-Pin SOT-23 Package 0.95 mm Pitch, 2.3 mm Lead Span; ComponentLink1Description: Manufacturer Link; ComponentLink1URL: http://www.semiconductors.philips.com/; ComponentLink2Description: Datasheet; ComponentLink2URL: http://www.semiconductors.philips.com/acrobat/datasheets/BSS123_3.pdf; Distributor Link: https://eu.mouser.com/ProductDetail/ON-Semiconductor/BSS123LT1G?qs=sGAEpiMZZMshyDBzk1%2fWizSW%252bwlCH%2fhMYWCTWBfWgg8%3d; Manufacturer Part No.: BSS123
R17-R35 = Res2: Resistor; Note: We have them in Bulgaria; Published: 8-Jun-2000; LatestRevisionDate: 17-Jul-2002; LatestRevisionNote: Re-released for DXP Platform.; PackageReference: AXIAL-0.4; Publisher: Altium Limited; PackageDescription: Axial Device, Thru-Hole; 2 Leads; 0.4 in Pin Spacing; Case Code (in): 0603
  R17 R18 R24 R25 R28 R32 R35: Distributor Link: http://uk.farnell.com/yageo/rc0603fr-070rl/res-thick-film-0r-1-0-1w-0603/dp/2309106
  R27 R31: Distributor Link: https://uk.farnell.com/vishay/mct06030c1001fp500/res-1k-1-0-1w-0603-thin-film/dp/2325213
  R29: Distributor Link: http://uk.farnell.com/multicomp/mcwr06x1002ftl/res-thick-film-10k-1-0-1w-0603/dp/2447230
U2-U4 = MC1458D: Dual General-Purpose Operational Amplifier; Manufacturer Name: TI; Note: Get 6 more.; Published: 15-Apr-2002; LatestRevisionDate: 13-Apr-2006; LatestRevisionNote: IPC-7351 Footprint Added.; DatasheetVersion: May-1988; PackageVersion: Jan-1998; PackageReference: D008; Publisher: Altium Limited; PackageDescription: 8-Pin Small Outline Integrated Circuit 1.27 mm Pitch; Code_IPC: SOIC127P600-8; ComponentLink1Description: Manufacturer Link; ComponentLink1URL: http://www.ti.com/; ComponentLink2Description: Datasheet; ComponentLink2URL: http://www-s.ti.com/sc/ds/mc1458.pdf; Distributor Link: https://eu.mouser.com/ProductDetail/Texas-Instruments/OPA2325IDR?qs=%2Fha2pyFadujaAA%252BPt%2FaiSE4IhM8K7gbY8eM5jbLcXgs%3D; Manufacturer Part No.: OPA2325IDR

## Sheet [3]Digital.SchDoc
size A2
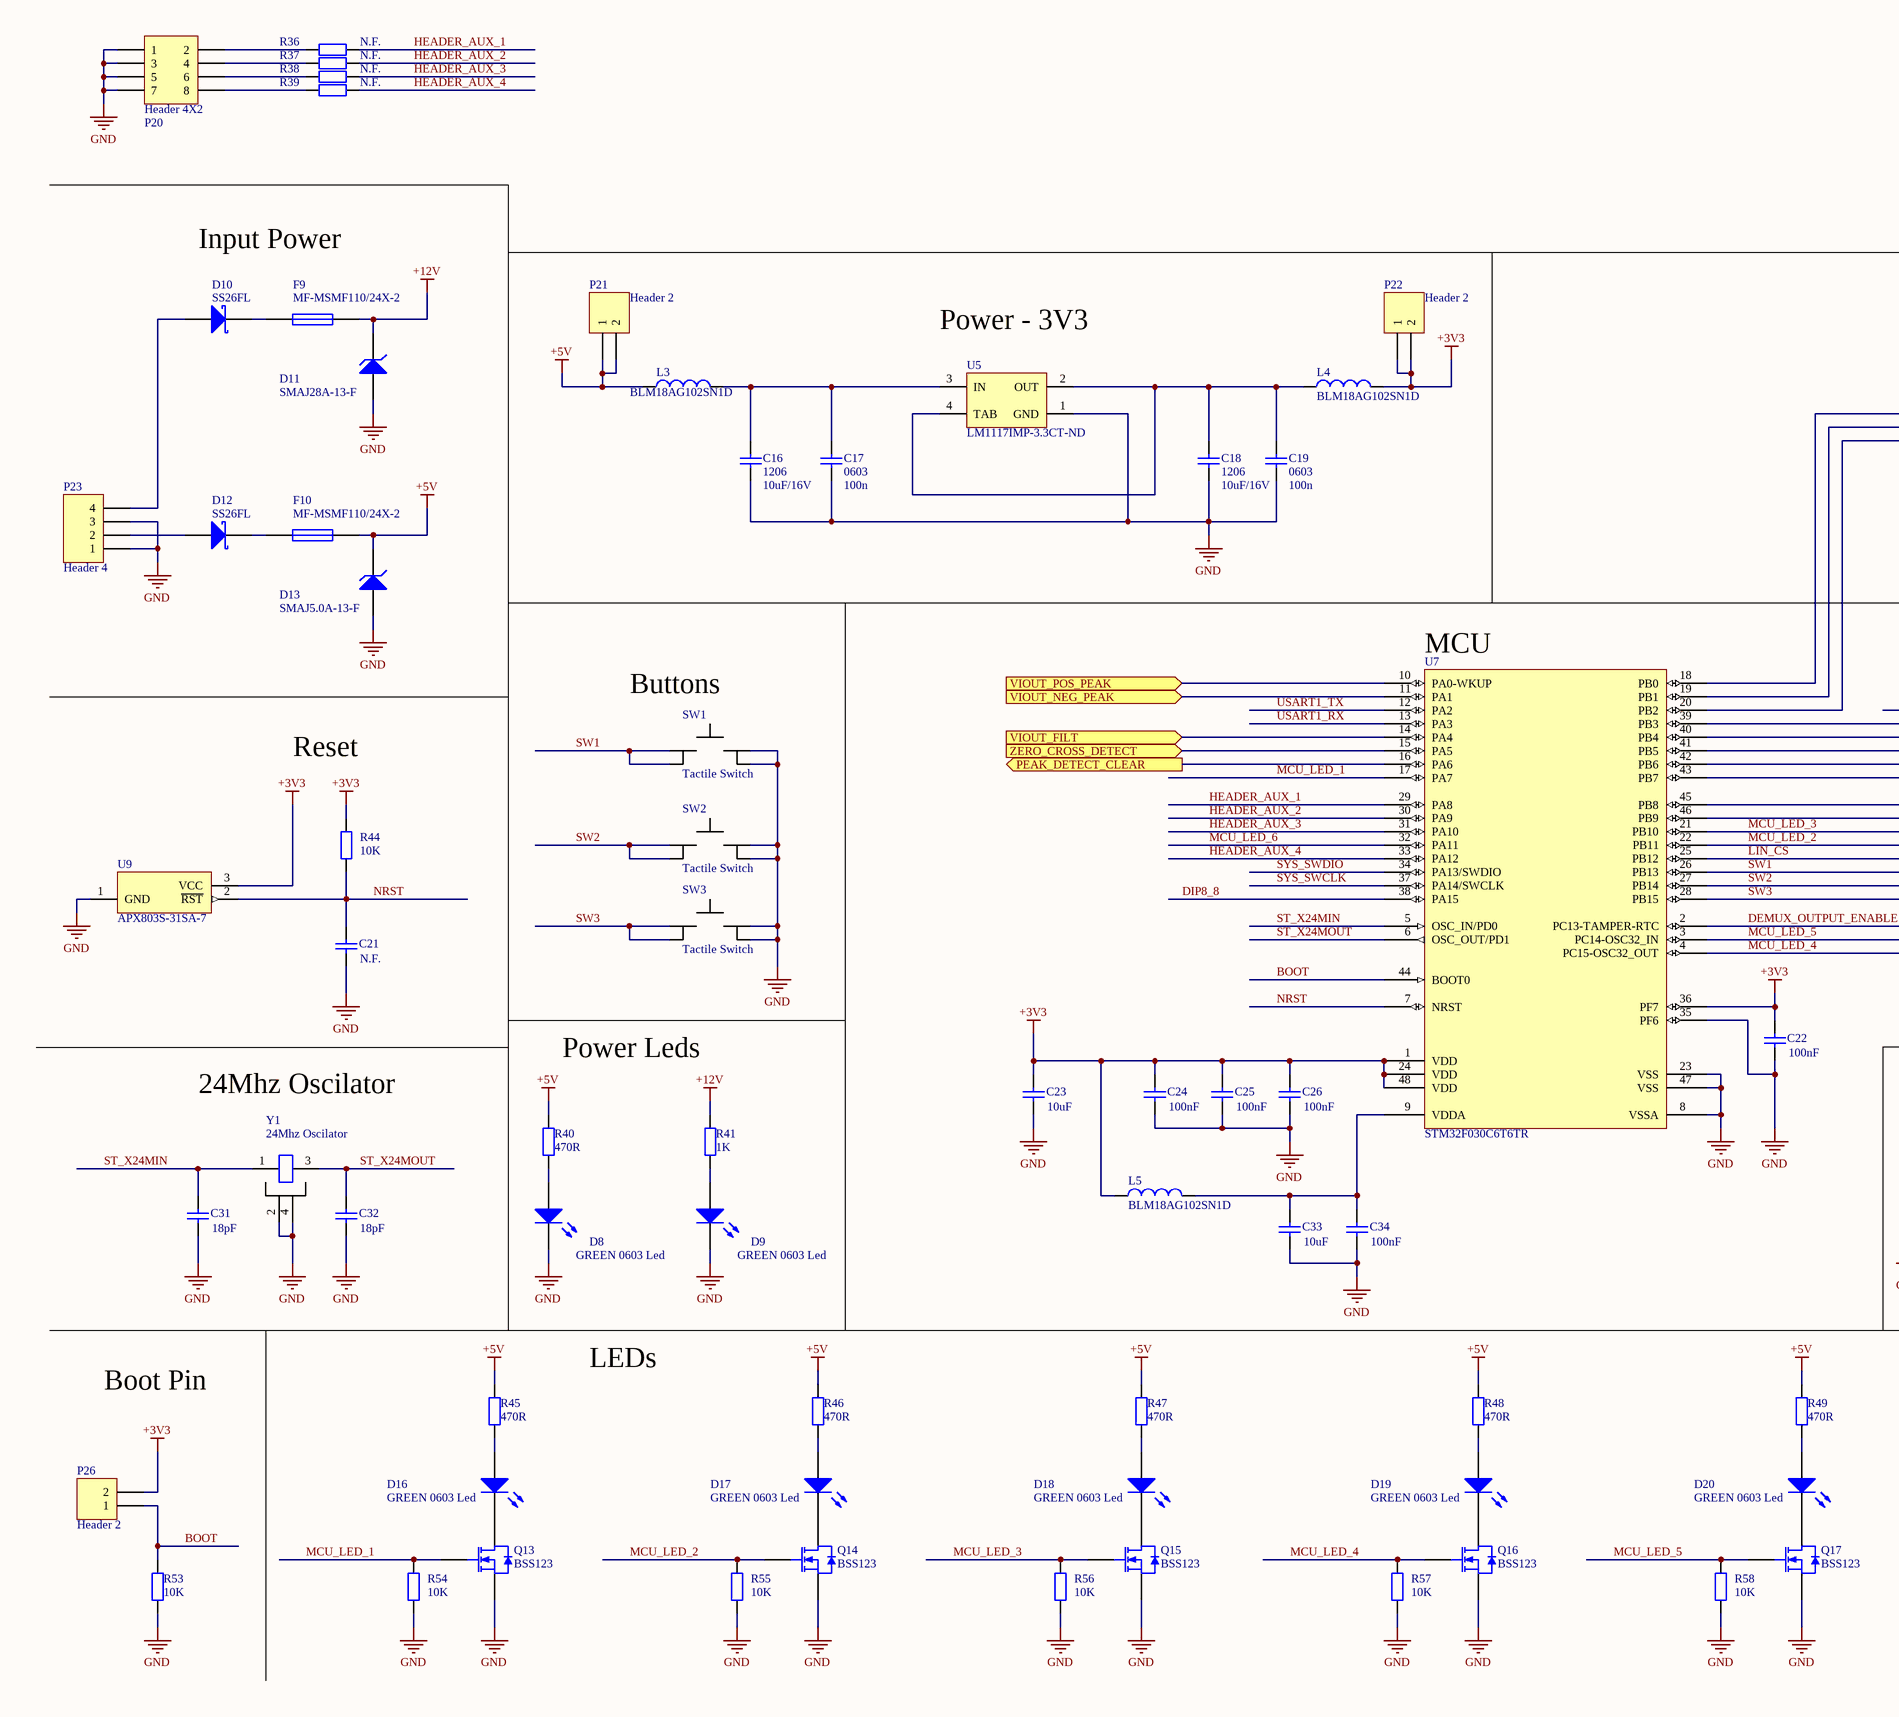
[diagram p7: [3]Digital.SchDoc, left]
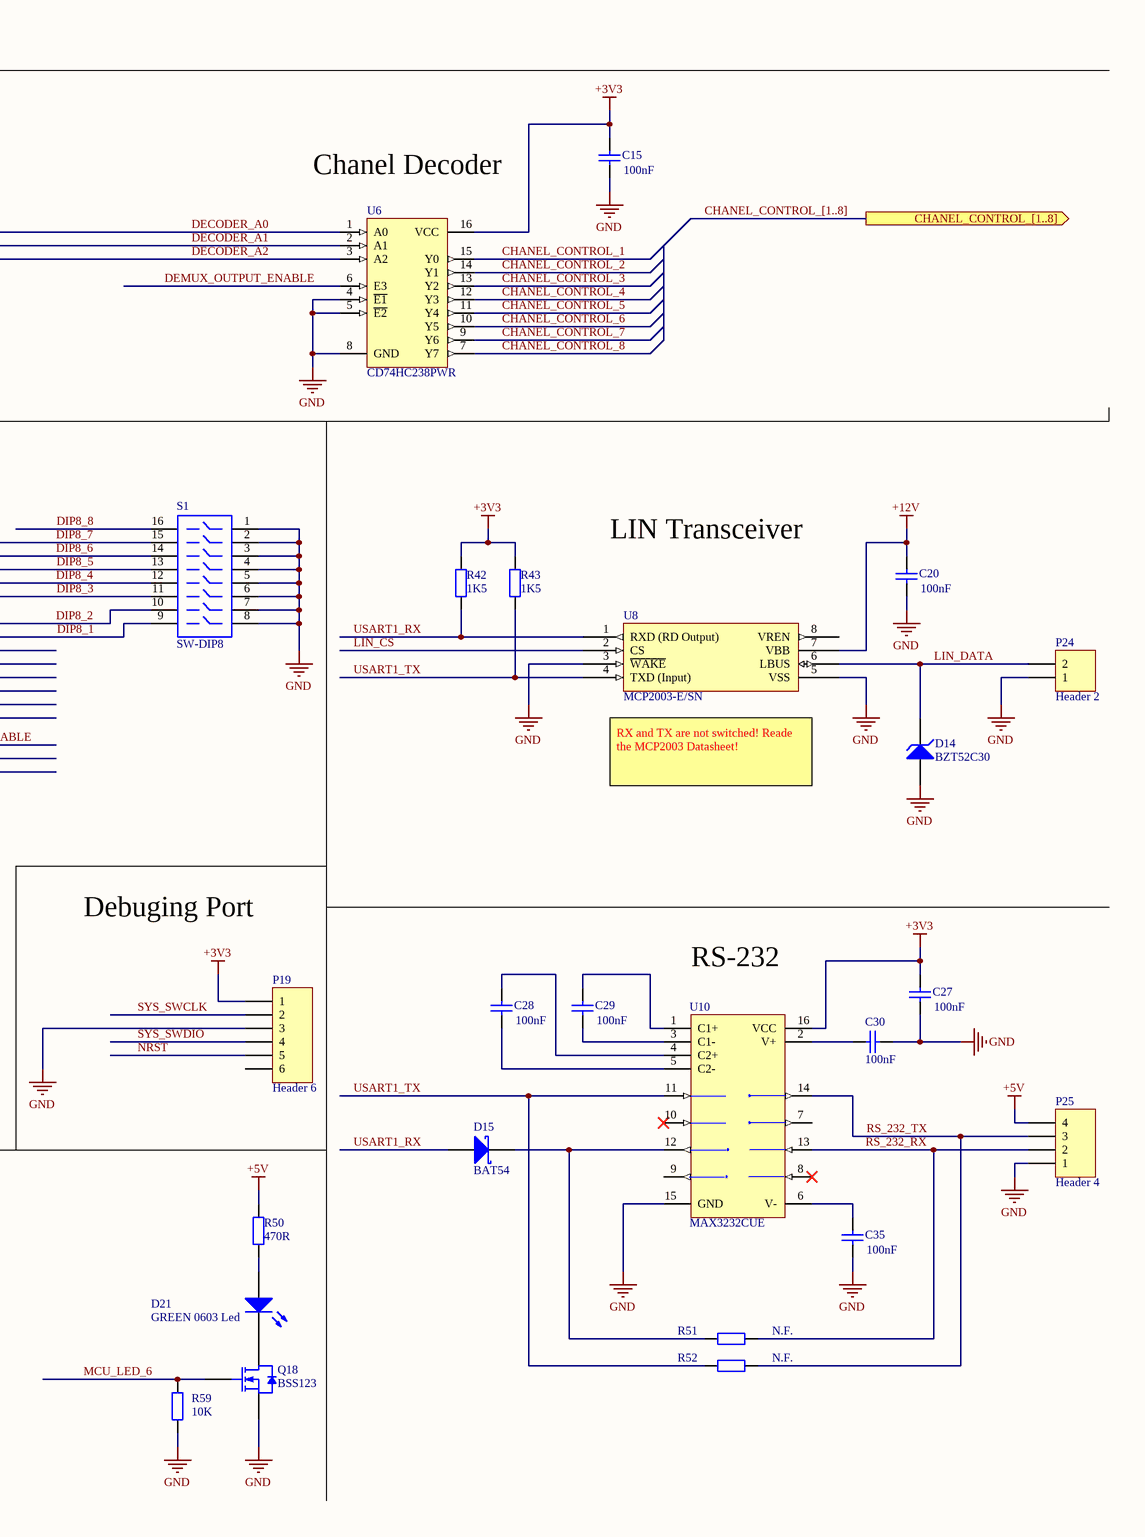
[diagram p8: [3]Digital.SchDoc, right]

### Parts
C15  value 100nF  [1608[0603]]  (hidden comment: 0603)
C16  1206  value 10uF/16V  [C1206]
C17  0603  value 100n  [1608[0603]]
C18  1206  value 10uF/16V  [C1206]
C19  0603  value 100n  [1608[0603]]
C20  value 100nF  [1608[0603]]  (hidden comment: 0603)
C21  value N.F.  [1608[0603]]  (hidden comment: 0603)
C22  value 100nF  [1608[0603]]  (hidden comment: 0603)
C23  value 10uF  [1608[0603]]  (hidden comment: 0603)
C24  value 100nF  [1608[0603]]  (hidden comment: 0603)
C25  value 100nF  [1608[0603]]  (hidden comment: 0603)
C26  value 100nF  [1608[0603]]  (hidden comment: 0603)
C27  value 100nF  [1608[0603]]  (hidden comment: 0603)
C28  value 100nF  [1608[0603]]  (hidden comment: 0603)
C29  value 100nF  [1608[0603]]  (hidden comment: 0603)
C30  value 100nF  [1608[0603]]  (hidden comment: 0603)
C31  value 18pF  [1608[0603]]  (hidden comment: 0603)
C32  value 18pF  [1608[0603]]  (hidden comment: 0603)
C33  value 10uF  [1608[0603]]  (hidden comment: 0603)
C34  value 100nF  [1608[0603]]  (hidden comment: 0603)
C35  value 100nF  [1608[0603]]  (hidden comment: 0603)
D8  GREEN 0603 Led  [LED0603]
D9  GREEN 0603 Led  [LED0603]
D10  SS26FL  [SOD123F]
D11  SMAJ28A-13-F  [SMA]
D12  SS26FL  [SOD123F]
D13  SMAJ5.0A-13-F  [SMA]
D14  BZT52C30  [SOD123]
D15  BAT54  [SOT-23_N]
D16  GREEN 0603 Led  [LED0603]
D17  GREEN 0603 Led  [LED0603]
D18  GREEN 0603 Led  [LED0603]
D19  GREEN 0603 Led  [LED0603]
D20  GREEN 0603 Led  [LED0603]
D21  GREEN 0603 Led  [LED0603]
F9  MF-MSMF110/24X-2  [CAPC4532L]
F10  MF-MSMF110/24X-2  [CAPC4532L]
L3  BLM18AG102SN1D  [1608[0603]]
L4  BLM18AG102SN1D  [1608[0603]]
L5  BLM18AG102SN1D  [1608[0603]]
P19  Header 6  [HDR1X6]
P20  Header 4X2  [HDR2X4]
P21  Header 2  [HDR1X2]
P22  Header 2  [HDR1X2]
P23  Header 4  [284391-4]
P24  Header 2  [284391-2]
P25  Header 4  [284391-4]
P26  Header 2  [HDR1X2]
Q13  BSS123  [SOT23_N]
Q14  BSS123  [SOT23_N]
Q15  BSS123  [SOT23_N]
Q16  BSS123  [SOT23_N]
Q17  BSS123  [SOT23_N]
Q18  BSS123  [SOT23_N]
R36  value N.F.  [J1-0603]  (hidden comment: 0603)
R37  value N.F.  [J1-0603]  (hidden comment: 0603)
R38  value N.F.  [J1-0603]  (hidden comment: 0603)
R39  value N.F.  [J1-0603]  (hidden comment: 0603)
R40  value 470R  [J1-0603]  (hidden comment: 0603)
R41  value 1K  [J1-0603]  (hidden comment: 0603)
R42  value 1K5  [J1-0603]  (hidden comment: 0603)
R43  value 1K5  [J1-0603]  (hidden comment: 0603)
R44  value 10K  [J1-0603]  (hidden comment: 0603)
R45  value 470R  [J1-0603]  (hidden comment: 0603)
R46  value 470R  [J1-0603]  (hidden comment: 0603)
R47  value 470R  [J1-0603]  (hidden comment: 0603)
R48  value 470R  [J1-0603]  (hidden comment: 0603)
R49  value 470R  [J1-0603]  (hidden comment: 0603)
R50  value 470R  [J1-0603]  (hidden comment: 0603)
R51  value N.F.  [J1-0603]  (hidden comment: 0603)
R52  value N.F.  [J1-0603]  (hidden comment: 0603)
R53  value 10K  [J1-0603]  (hidden comment: 0603)
R54  value 10K  [J1-0603]  (hidden comment: 0603)
R55  value 10K  [J1-0603]  (hidden comment: 0603)
R56  value 10K  [J1-0603]  (hidden comment: 0603)
R57  value 10K  [J1-0603]  (hidden comment: 0603)
R58  value 10K  [J1-0603]  (hidden comment: 0603)
R59  value 10K  [J1-0603]  (hidden comment: 0603)
S1  SW-DIP8  [DIP-16-KEY]
SW1  Tactile Switch  [FSM14JLH]
SW2  Tactile Switch  [FSM14JLH]
SW3  Tactile Switch  [FSM14JLH]
U5  LM1117IMP-3.3CT-ND  [MP04A_N]
U6  CD74HC238PWR  [TSOP65P640-16AL]
U7  STM32F030C6T6TR  [LQFP48_N]
U8  MCP2003-E/SN  [SOIC127P600-8AL]
U9  APX803S-31SA-7  [RT-3]
U10  MAX3232CUE  [TSSOP16_L]
Y1  24Mhz Oscilator  [SMD Crysta 2 x 1.6]

### Ports
CHANEL_CONTROL_[1..8] (out), PEAK_DETECT_CLEAR (out), VIOUT_FILT (in), VIOUT_NEG_PEAK (in), VIOUT_POS_PEAK (in), ZERO_CROSS_DETECT (in)

### Nets
+3V3: C15.2 C22.2 C23.2 C24.2 C25.2 C26.2 C27.2 L4.2 L5.1 P19.1 P22.1 P22.2 P26.2 R42.2 R43.2 R44.2 U6.16(VCC) U7.1(VDD) U7.24(VDD) U7.36(PF7) U7.48(VDD) U9.3(VCC) U10.16(VCC)
+5V: D13.2(K) F10.2 L3.1 P21.1 P21.2 P25.4 R40.2 R45.2 R46.2 R47.2 R48.2 R49.2 R50.2
+12V: C20.2 D11.2(K) F9.2 R41.2 U8.7(VBB)
GND: C15.1 C16.1 C17.1 C18.1 C19.1 C20.1 C21.1 C22.1 C23.1 C24.1 C25.1 C26.1 C27.1 C30.1 C31.2 C32.2 C33.1 C34.1 C35.1 D8.2(K) D9.2(K) D11.1(A) D13.1(A) D14.1(A) P19.3 P20.1 P20.3 P20.5 P20.7 P23.1 P23.3 P24.1 P25.1 Q13.2(S) Q14.2(S) Q15.2(S) Q16.2(S) Q17.2(S) Q18.2(S) R53.2 R54.1 R55.1 R56.1 R57.1 R58.1 R59.1 S1.1 S1.2 S1.3 S1.4 S1.5 S1.6 S1.7 S1.8 SW1.1 SW1.2 SW2.1 SW2.2 SW3.1 SW3.2 U5.1(GND) U6.4(~{E1}) U6.5(~{E2}) U6.8(GND) U7.8(VSSA) U7.23(VSS) U7.35(PF6) U7.47(VSS) U8.3(~{WAKE}) U8.5(VSS) U9.1(GND) U10.15(GND) Y1.2(GND) Y1.4
BOOT: P26.1 R53.1 U7.44(BOOT0)
CHANEL_CONTROL_1: U6.15(Y0)
CHANEL_CONTROL_2: U6.14(Y1)
CHANEL_CONTROL_3: U6.13(Y2)
CHANEL_CONTROL_4: U6.12(Y3)
CHANEL_CONTROL_5: U6.11(Y4)
CHANEL_CONTROL_6: U6.10(Y5)
CHANEL_CONTROL_7: U6.9(Y6)
CHANEL_CONTROL_8: U6.7(Y7)
DECODER_A0: U6.1(A0) U7.18(PB0)
DECODER_A1: U6.2(A1) U7.19(PB1)
DECODER_A2: U6.3(A2) U7.20(PB2)
DEMUX_OUTPUT_ENABLE: U6.6(E3) U7.2(PC13-TAMPER-RTC)
DIP8_1: S1.9 U7.46(PB9)
DIP8_2: S1.10 U7.45(PB8)
DIP8_3: S1.11 U7.43(PB7)
DIP8_4: S1.12 U7.42(PB6)
DIP8_5: S1.13 U7.41(PB5)
DIP8_6: S1.14 U7.40(PB4)
DIP8_7: S1.15 U7.39(PB3)
DIP8_8: S1.16 U7.38(PA15)
HEADER_AUX_1: R36.1 U7.29(PA8)
HEADER_AUX_2: R37.1 U7.30(PA9)
HEADER_AUX_3: R38.1 U7.31(PA10)
HEADER_AUX_4: R39.1 U7.33(PA12)
LIN_CS: U7.25(PB12) U8.2(CS)
LIN_DATA: D14.2(K) P24.2 U8.6(LBUS)
MCU_LED_1: Q13.1(G) R54.2 U7.17(PA7)
MCU_LED_2: Q14.1(G) R55.2 U7.22(PB11)
MCU_LED_3: Q15.1(G) R56.2 U7.21(PB10)
MCU_LED_4: Q16.1(G) R57.2 U7.4(PC15-OSC32_OUT)
MCU_LED_5: Q17.1(G) R58.2 U7.3(PC14-OSC32_IN)
MCU_LED_6: Q18.1(G) R59.2 U7.32(PA11)
NRST: C21.2 P19.5 R44.1 U7.7(NRST) U9.2(~{RST})
RS_232_RX: P25.2 R51.2 U10.13(R1IN)
RS_232_TX: P25.3 R52.2 U10.14(T1OUT)
ST_X24MIN: C31.1 U7.5(OSC_IN/PD0) Y1.1(OSC1)
ST_X24MOUT: C32.1 U7.6(OSC_OUT/PD1) Y1.3(OSC2)
SW1: SW1.3 SW1.4 U7.26(PB13)
SW2: SW2.3 SW2.4 U7.27(PB14)
SW3: SW3.3 SW3.4 U7.28(PB15)
SYS_SWCLK: P19.2 U7.37(PA14/SWCLK)
SYS_SWDIO: P19.4 U7.34(PA13/SWDIO)
USART1_RX: D15.1(A) R42.1 U7.13(PA3) U8.1(RXD_(RD_Output))
USART1_TX: R43.1 R52.1 U7.12(PA2) U8.4(TXD_(Input)) U10.11(T1IN)
VIOUT_NEG_PEAK: U7.11(PA1) ; port VIOUT_NEG_PEAK
VIOUT_POS_PEAK: U7.10(PA0-WKUP) ; port VIOUT_POS_PEAK
NetC16_2: C16.2 C17.2 L3.2 U5.3(IN)
NetC18_2: C18.2 C19.2 L4.1 U5.2(OUT) U5.4(TAB)
NetC28_1: C28.1 U10.5(C2-)
NetC28_2: C28.2 U10.4(C2+)
NetC29_1: C29.1 U10.3(C1-)
NetC29_2: C29.2 U10.1(C1+)
NetC30_2: C30.2 U10.2(V+)
NetC33_2: C33.2 C34.2 L5.2 U7.9(VDDA)
NetC35_2: C35.2 U10.6(V-)
NetD8_1: D8.1(A) R40.1
NetD9_1: D9.1(A) R41.1
NetD10_1: D10.1(A) P23.4
NetD10_2: D10.2(K) F9.1
NetD12_1: D12.1(A) P23.2
NetD12_2: D12.2(K) F10.1
NetD15_3: D15.3(K) R51.1 U10.12(R1OUT)
NetD16_1: D16.1(A) R45.1
NetD16_2: D16.2(K) Q13.3(D)
NetD17_1: D17.1(A) R46.1
NetD17_2: D17.2(K) Q14.3(D)
NetD18_1: D18.1(A) R47.1
NetD18_2: D18.2(K) Q15.3(D)
NetD19_1: D19.1(A) R48.1
NetD19_2: D19.2(K) Q16.3(D)
NetD20_1: D20.1(A) R49.1
NetD20_2: D20.2(K) Q17.3(D)
NetD21_1: D21.1(A) R50.1
NetD21_2: D21.2(K) Q18.3(D)
NetOPT1_5: U7.15(PA5) ; port ZERO_CROSS_DETECT
NetP9_1: U7.14(PA4) ; port VIOUT_FILT
NetP17_1: U7.16(PA6) ; port PEAK_DETECT_CLEAR
NetP20_2: P20.2 R36.2
NetP20_4: P20.4 R37.2
NetP20_6: P20.6 R38.2
NetP20_8: P20.8 R39.2

Not connected (* = marked no-connect by the designer): P19 6; U8 8(VREN); U10 7(T2OUT) 8(R2IN)* 9(R2OUT) 10(T2IN)*

### Buses and harness runs
bus CHANEL_CONTROL_[1..8] = port CHANEL_CONTROL_[1..8]

### Notes on the sheet
- Input Power
- (near U5) Power - 3V3
- (near U6) Chanel Decoder
- (near U7) MCU
- (near SW1) Buttons
- LIN Transceiver
- Reset
- (near U8) RX and TX are not switched! Reade the MCP2003 Datasheet!
- Power Leds
- 24Mhz Oscilator
- Debuging Port
- RS-232
- Boot Pin
- LEDs

### Library data of the parts
C15-C35 = Cap: as C1 on sheet [1]High_Power; Published: 8-Jun-2000; LatestRevisionDate: 17-Jul-2002; LatestRevisionNote: Re-released for DXP Platform.; PackageReference: RAD-0.3; Publisher: Altium Limited; PackageDescription: Radial Cap, Thru-Hole; 2 Leads; 0.3 in Pin Spacing
  C15 C17 C19 C20 C22 C24-C30 C34 C35: Distributor Link: http://uk.farnell.com/kemet/c0603x104k4ractu/cap-mlcc-x7r-100nf-16v-0603/dp/1414027; Case Code (in): 0603
  C16 C18: Distributor Link: http://uk.farnell.com/kemet/c1206c106k4ractu/cap-mlcc-x7r-10uf-16v-1206/dp/1463368; Case Code (in): 1206
  C21: Case Code (in): 0603
  C23 C33: Distributor Link: https://eu.mouser.com/ProductDetail/Taiyo-Yuden/JMK107ABJ106MA-T?qs=sGAEpiMZZMvsSlwiRhF8qtYrDJZp5VWM0KJHW32Kpw4hdLhJsFnoCA%3d%3d; Case Code (in): 0603
  C31 C32: Distributor Link: https://eu.mouser.com/ProductDetail/AVX/06035A180JAT4A?qs=sGAEpiMZZMvsSlwiRhF8qoLJPdUUh17q4jx5a%252bHkpSk%3d; Case Code (in): 0603
D8 D9 D16-D21 = LED0: as D22 on sheet [1.1]MOC_Channel; Published: 8-Jun-2000; LatestRevisionDate: 08-Jul-2005; LatestRevisionNote: Mech Layer 1 removed.; PackageReference: LED-0; Publisher: Altium Limited; PackageDescription: LED; 2 Leads; Distributor Link: http://uk.farnell.com/kingbright/kpt-1608cgck/led-green-0603-smd/dp/2099220; Price (per 100 in GBP): 0.09
D10 D12 = Diode 11DQ03: Schottky Rectifier; Manufacturer Name: ON Semiconductor / Fairchild; Note: We have them in Bulgaria; Published: 8-Jun-2000; LatestRevisionDate: 17-Jul-2002; LatestRevisionNote: Re-released for DXP Platform.; DatasheetVersion: Dec-1997; PackageReference: DO-204AL; Publisher: Altium Limited; PackageDescription: Diode, Axial; Body 5.2 x 2.7 mm (LxDia. max), Lead Dia. 0.86 mm (max); Code_JEDEC: DO-204-AL; ComponentLink1Description: Manufacturer Link; ComponentLink1URL: http://www.irf.com/; ComponentLink2Description: Datasheet; ComponentLink2URL: http://www.irf.com/product-info/datasheets/data/11dq03.pdf; Manufacturer Part No.: SS26FL; Distributor Link: https://eu.mouser.com/ProductDetail/ON-Semiconductor-Fairchild/SS26FL?qs=%2fha2pyFadujLdiyCszVoPuNvgYhu%2f%252bxuyuTPMeW7IG4%3d
D11 D13 = D Zener: Zener Diode; Manufacturer Name: Diodes Incorporated; Note: We have them in Bulgaria; Published: 8-Jun-2000; LatestRevisionDate: 17-Jul-2002; LatestRevisionNote: Re-released for DXP Platform.; PackageReference: DIODE-0.7; Publisher: Altium Limited; Price (per 100 in GBP): 0.12
  D11: Distributor Link: https://eu.mouser.com/ProductDetail/Diodes-Incorporated/SMAJ28A-13-F?qs=gaDBXWSqsDBA900rgyLC7w==; Manufacturer Part No.: SMAJ28A-13-F
  D13: Distributor Link: https://www.digikey.bg/product-detail/en/diodes-incorporated/SMAJ5.0A-13-F/SMAJ5.0A-FDICT-ND/816522; Manufacturer Part No.: SMAJ5.0A-13-F
D14 = D Zener: Zener Diode; Manufacturer Name: Diodes Incorporated; Manufacturer Part No.: BZT52C30-7-F; Published: 8-Jun-2000; LatestRevisionDate: 17-Jul-2002; LatestRevisionNote: Re-released for DXP Platform.; PackageReference: DIODE-0.7; Publisher: Altium Limited; PackageDescription: Diode, Thru-Hole; 2 Leads; 0.7 in Pin Spacing; Distributor Link: https://eu.mouser.com/ProductDetail/Diodes-Incorporated/BZT52C30-7-F?qs=zLeapIUCO8RFisLH9UF7WA%3D%3D
D15 = Diode BAT17: as D6 on sheet [2]Analog; Published: 21-Mar-2003; LatestRevisionDate: 29-May-2009; LatestRevisionNote: IPC-7351 Footprint Added.; DatasheetVersion: Oct-1999; PackageVersion: Sep-2001; PackageReference: SOT-23; Publisher: Altium Limited; PackageDescription: 3-Pin SOT-23 Package 0.95 mm Pitch, 2.5 mm Lead Span; ComponentLink1Description: Manufacturer Link; ComponentLink1URL: http://www.infineon.com/; ComponentLink2Description: Datasheet; ComponentLink2URL: http://www.infineon.com/upload/Document/cmc_upload/documents/009/363/bat17series.pdf; Distributor Link: https://uk.farnell.com/on-semiconductor/bat54lt1g/diode-signal-30v-sot-23/dp/1431113
F9 F10 = Fuse 1: Fuse; Manufacturer Name: Bourns; Manufacturer Part No.: MF-MSMF050-2; Note: We have them in Bulgaria; Published: 8-Jun-2000; LatestRevisionDate: 17-Jul-2002; LatestRevisionNote: Re-released for DXP Platform.; PackageReference: PIN-W2/E2.8; Publisher: Altium Limited; Price (per 100 in GBP): 0.08
L3-L5 = Inductor: as L1 on sheet [1]High_Power; Manufacturer Part No.: BLM18AG102SN1D; Distributor Link: https://eu.mouser.com/ProductDetail/Murata-Electronics/BLM18AG102SN1D?qs=%2fha2pyFadui%252bmEFJIul6r5GpWOyARRlB97lxmShlzChqi9G%252bTjWC9w%3d%3d
P19 = Header 6: Header, 6-Pin; LatestRevisionDate: 17-Jul-2002; LatestRevisionNote: Re-released for DXP Platform.; Publisher: Altium Limited
P20 = Header 4X2: Header, 4-Pin, Dual row; LatestRevisionDate: 17-Jul-2002; LatestRevisionNote: Re-released for DXP Platform.; Publisher: Altium Limited
P21 P22 P24 P26 = Header 2: Header, 2-Pin; LatestRevisionDate: 17-Jul-2002; LatestRevisionNote: Re-released for DXP Platform.; Publisher: Altium Limited
P23 P25 = Header 4: Header, 4-Pin; LatestRevisionDate: 17-Jul-2002; LatestRevisionNote: Re-released for DXP Platform.; Publisher: Altium Limited
Q13-Q18 = BSS123: as Q19 on sheet [1.1]MOC_Channel; Published: 17-Sep-2003; LatestRevisionDate: 12-Dec-2006; LatestRevisionNote: IPC-7351 Footprint Added.; DatasheetVersion: Apr-1995; PackageVersion: May-1999; PackageReference: SOT23; Publisher: Altium Limited; PackageDescription: 3-Pin SOT-23 Package 0.95 mm Pitch, 2.3 mm Lead Span; ComponentLink1Description: Manufacturer Link; ComponentLink1URL: http://www.semiconductors.philips.com/; ComponentLink2Description: Datasheet; ComponentLink2URL: http://www.semiconductors.philips.com/acrobat/datasheets/BSS123_3.pdf; Distributor Link: https://eu.mouser.com/ProductDetail/ON-Semiconductor/BSS123LT1G?qs=sGAEpiMZZMshyDBzk1%2fWizSW%252bwlCH%2fhMYWCTWBfWgg8%3d; Manufacturer Part No.: BSS123
R36-R59 = Res2: Resistor; Note: We have them in Bulgaria; Published: 8-Jun-2000; LatestRevisionDate: 17-Jul-2002; LatestRevisionNote: Re-released for DXP Platform.; PackageReference: AXIAL-0.4; Publisher: Altium Limited; PackageDescription: Axial Device, Thru-Hole; 2 Leads; 0.4 in Pin Spacing; Case Code (in): 0603
  R40 R45-R50: Distributor Link: https://uk.farnell.com/vishay/crcw0603470rfkea/res-470r-1-0-1w-0603-thick-film/dp/1469815RL
  R41: Distributor Link: https://uk.farnell.com/vishay/mct06030c1001fp500/res-1k-1-0-1w-0603-thin-film/dp/2325213
  R42 R43: Distributor Link: https://uk.farnell.com/panasonic/erj3ekf1501v/res-1k5-1-0-1w-0603-thick-film/dp/2303156
  R44 R53-R59: Distributor Link: http://uk.farnell.com/multicomp/mcwr06x1002ftl/res-thick-film-10k-1-0-1w-0603/dp/2447230
S1 = SW-DIP8: 4009 Series DIP Switch, Raised actuator; Manufacturer Name: CTS Electronic Components; Manufacturer Part No.: 210-8MS; Published: 24-Mar-1999; LatestRevisionDate: 17-Dec-2003; LatestRevisionNote: PCB Footprint replaced.; PackageReference: DIP-16-KEY; Publisher: Altium Limited; PackageDescription: DIP; 16 Leads; Row Spacing 7.62 mm; Pitch 2.54 mm; ComponentLink1Description: Manufacturer Link; ComponentLink1URL: http://www.oupiin.com/prodindx.html#Headers; Distributor Link: https://eu.mouser.com/ProductDetail/CTS-Electronic-Components/210-8MS?qs=sGAEpiMZZMv%2F%252B2JhlA6ysCW5ZokGCVhUojtEeWEz7Rc%3D
SW1-SW3 = Tactile Switch: Manufacturer Name: TE Connectivity; Manufacturer Part No.: FSM4JH; Distributor Link: https://eu.mouser.com/ProductDetail/TE-Connectivity-Alcoswitch/FSM4JH?qs=sGAEpiMZZMsgGjVA3toVBAK0o4DxfcqijSchET4px6U%3D; Price (per 100 in GBP): 0.12
U5 = LM1117IMP-3.3: 800mA Low-Dropout Linear Regulator; Manufacturer: National Semiconductor; Manufacturer Name: TI; CompType: LDO IC; PackageTopMarking: XYTT*N05B; PowerWise: N; Published: 4-Dec-2008; DatasheetVersion: Apr-2006; PackageVersion: revB, Apr-2003; PackageReference: MP04A; Publisher: Altium Limited; PackageDescription: Molded SOT-223, 6.50 x 3.56 x 1.6mm Body, 4 Lead, 2.3mm Pitch; PartNumber: LM1117IMP-3.3; RoHS: O; PinCount: 4; DigiKeyPartNumber: LM1117IMP-3.3CT-ND; Code_JEDEC: TO-261-AA; Code_IPC: SOT223-4; ComponentLink1Description: LM1117 Datasheet; ComponentLink1URL: http://www.national.com/ds/LM/LM1117.pdf; ComponentLink2Description: LM1117 Web Page; ComponentLink2URL: http://www.national.com/pf/LM/LM1117.html; ComponentLink3Description: MP04A Package Page; ComponentLink3URL: http://www.national.com/packaging/folders/mp04a.html; Manufacturer Part No.: LM1117IMP-3.3CT-ND; Distributor Link: http://uk.farnell.com/texas-instruments/lm1117imp-3-3-nopb/ldo-1-2vdo-3-3v-1-0-8a-3sot223/dp/1469051
U6 = CD74HC238PWR: High-Speed CMOS Logic 3- to 8-Line Decoder/Demultiplexer Inverting; Manufacturer Name: Texas Instruments; Distributor Link: https://www.mouser.co.uk/ProductDetail/Texas-Instruments/CD74HC238PWR?qs=sGAEpiMZZMtxONTBFIcRfgMIbQHDmxeviPxqNdAY%252BDU%3D; Manufacturer Part No.: CD74HC238PWR
U7 = STM32F030x4/6/8: STM32 ARM-based 32-bit MCU with 32 Kbytes Flash, 48-pin LQFP, Industrial Temperature; Manufacturer Name: STMicroelectronics; Note: Get 3 more.; Published: 30-May-2008; DatasheetVersion: rev6, Mar-2008; PackageVersion: Mar-2008; PackageReference: LQFP48; Publisher: Altium Limited; PackageDescription: 48-Pin Low-Profile Quad Flat Pack, 7 x 7 mm Body, 0.5 mm Pitch (LQFP48); ComponentLink1Description: Manufacturer Link; ComponentLink1URL: www.st.com/stm32; ComponentLink2Description: Datasheet; ComponentLink2URL: http://www.st.com/stonline/products/literature/ds/13586.pdf; Distributor Link: https://eu.mouser.com/ProductDetail/STMicroelectronics/STM32F030C6T6TR?qs=4b8myOmUP%252Bv8Ez53btAbrA%3D%3D; Manufacturer Part No.: STM32F030C6T6TR
U8 = MCP2003: LIN J2602 Transceiver; Manufacturer Name: Microchip Technology; Distributor Link: https://eu.mouser.com/ProductDetail/Microchip-Technology/MCP2003-E-SN?qs=ktxxVfK6xptrXDCRqAtS%252Bg%3D%3D; Manufacturer Part No.: MCP2003-E/SN
U9 = ADM809TART: Microprocessor Supervisory Circuit in 3-Pin SOT-23; Manufacturer Name: Diodes Incorporated; G2K_PN: G-IC-APX803-31SA-SOT-23-01; Note: We have them in Bulgaria; Published: 8-Jun-2000; LatestRevisionDate: 17-Jul-2002; LatestRevisionNote: Re-released for DXP Platform.; DatasheetVersion: REV.0 1997; PackageVersion: rev0; PackageReference: RT-3; Publisher: Altium Limited; PackageDescription: SOT-23; 3 Leads; Body 3.0 x 2.6 mm, inc. leads (LxW max); ComponentLink1Description: Manufacturer Link; ComponentLink1URL: http://www.analog.com/en/prod/0,,766_822_ADM809%2C00.html; ComponentLink2Description: Datasheet; ComponentLink2URL: http://www.analog.com/UploadedFiles/Data_Sheets/101131995ADM803_9_10_e.pdf; Price: .0; Price break at: 1000; Distributor Link: https://eu.mouser.com/ProductDetail/Diodes-Incorporated/APX803S-31SA-7?qs=%2Fha2pyFaduhebEAPwwFyerWu7K%252BS8dKoSHRSm1tt3Sf7eJGT%2FIrr6g%3D%3D; Manufacturer Part No.: APX803S-31SA-7; Price (per 100 in GBP): 0.11
U10 = MAX3232CUE: 3.0V TO 5.5V, Low-Power, up to 1Mbps, True RS-232 Transceiver Using Four 0.1µF External Capacitor; Manufacturer Part No.: MAX3232EIPWRQ1; Manufacturer Name: TI; Published: 16-Jan-2001; LatestRevisionDate: 29-May-2009; LatestRevisionNote: IPC-7351 Footprint Added.; DatasheetVersion: Mar-1999; PackageVersion: 21-0066 C; PackageReference: TSSOP16; Publisher: Altium Limited; PackageDescription: 16-Pin Thin Small Outline Package 0.65 mm Pitch; ComponentLink1Description: Manufacturer Link; ComponentLink1URL: http://www.maxim-ic.com/; ComponentLink2Description: Datasheet; ComponentLink2URL: http://pdfserv.maxim-ic.com/en/ds/MAX3222-MAX3241.pdf; Distributor Link: http://uk.farnell.com/texas-instruments/max3232eipwrq1/line-driv-rcvr-rs232-250kbps-ssop/dp/2335570
Y1 = XTAL: Manufacturer Name: AVX; Manufacturer Part No.: XRCGB24M000F2P00R0; Distributor Link: https://uk.farnell.com/murata/xrcgb24m000f2p00r0/crystal-24mhz-6pf-2-x-1-6mm/dp/2455832RL; Price (per 100 in GBP): 0.21